# Altium project PSFB.PrjPcb (part 1 of 2)
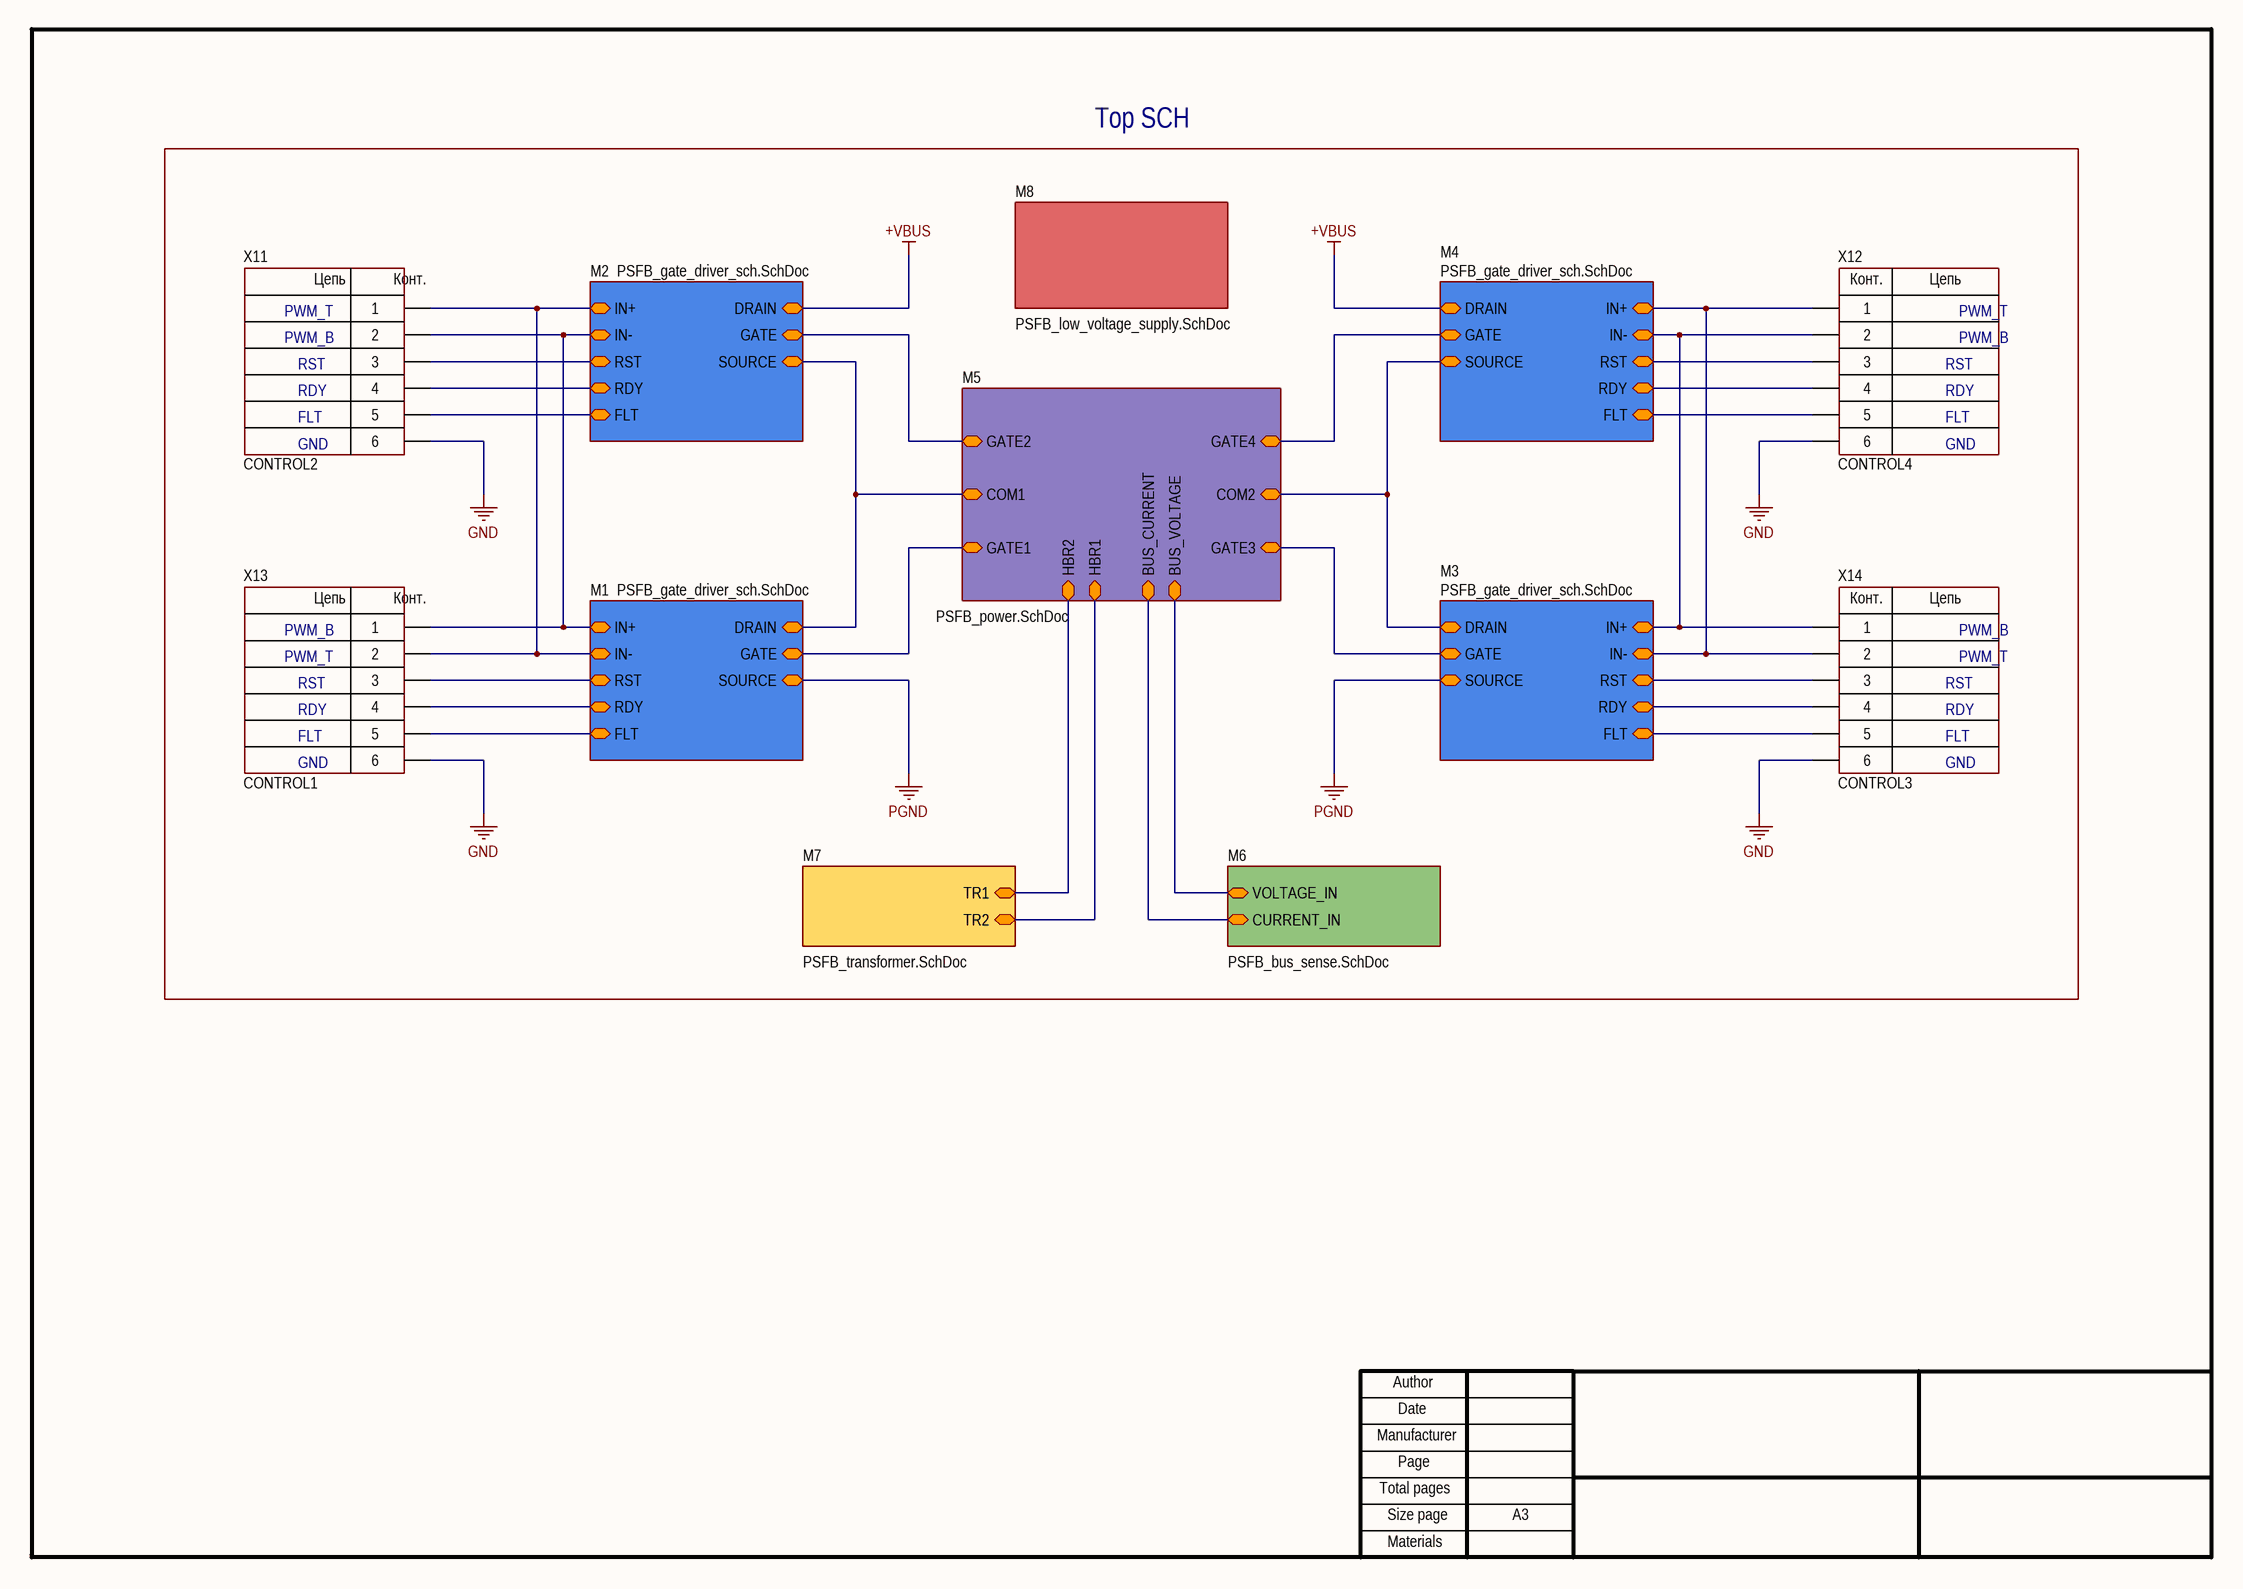
[diagram p0: PSFB_top_level.SchDoc]
6 sheets, 296 parts. Net scope: hierarchical (ports join the sheet entries above them; power ports are global).
Board file: PSFB_PCB.PcbDoc
Sheets:
  PSFB_top_level.SchDoc
    M6 = PSFB_bus_sense.SchDoc
    M1 = PSFB_gate_driver_sch.SchDoc
    M5 = PSFB_power.SchDoc
    M7 = PSFB_transformer.SchDoc
    M8 = PSFB_low_voltage_supply.SchDoc
    M2 = PSFB_gate_driver_sch.SchDoc
    M3 = PSFB_gate_driver_sch.SchDoc
    M4 = PSFB_gate_driver_sch.SchDoc

## Sheet PSFB_top_level.SchDoc
size 420 x 297 mm

### Parts
X11  CommentText: CONTROL2  [CON: SM06B-GHS]
X12  CommentText: CONTROL4  [CON: SM06B-GHS]
X13  CommentText: CONTROL1  [CON: SM06B-GHS]
X14  CommentText: CONTROL3  [CON: SM06B-GHS]

### Sub-sheets
M1 = PSFB_gate_driver_sch.SchDoc: RST (bidir), IN+ (bidir), RDY (bidir), FLT (bidir), IN- (bidir), GATE (bidir), SOURCE (bidir), DRAIN (bidir)
M2 = PSFB_gate_driver_sch.SchDoc: RST (bidir), IN+ (bidir), RDY (bidir), FLT (bidir), IN- (bidir), GATE (bidir), SOURCE (bidir), DRAIN (bidir)
M3 = PSFB_gate_driver_sch.SchDoc: RST (bidir), IN+ (bidir), RDY (bidir), FLT (bidir), IN- (bidir), GATE (bidir), SOURCE (bidir), DRAIN (bidir)
M4 = PSFB_gate_driver_sch.SchDoc: RST (bidir), IN+ (bidir), RDY (bidir), FLT (bidir), IN- (bidir), GATE (bidir), SOURCE (bidir), DRAIN (bidir)
M5 = PSFB_power.SchDoc: GATE1 (bidir), GATE2 (bidir), GATE3 (bidir), GATE4 (bidir), COM1 (bidir), COM2 (bidir), HBR1 (bidir), BUS_VOLTAGE (bidir), BUS_CURRENT (bidir), HBR2 (bidir)
M6 = PSFB_bus_sense.SchDoc: VOLTAGE_IN (bidir), CURRENT_IN (bidir)
M7 = PSFB_transformer.SchDoc: TR1 (bidir), TR2 (bidir)
M8 = PSFB_low_voltage_supply.SchDoc: no entries

### Nets
+VBUS: sheet M2/DRAIN, sheet M4/DRAIN
GND: X11.6 X12.6 X13.6 X14.6
PGND: sheet M1/SOURCE, sheet M3/SOURCE
NetC10_M2_2: sheet M1/DRAIN, sheet M5/COM1, sheet M2/SOURCE
NetC10_M4_2: sheet M5/COM2, sheet M5/HBR2, sheet M7/TR1, sheet M3/DRAIN, sheet M4/SOURCE
NetC27_2: sheet M5/HBR1, sheet M7/TR2
NetD4_M1_7: sheet M1/GATE, sheet M5/GATE1
NetD4_M2_7: sheet M5/GATE2, sheet M2/GATE
NetD4_M3_7: sheet M5/GATE3, sheet M3/GATE
NetD4_M4_7: sheet M5/GATE4, sheet M4/GATE
NetR1_2: sheet M6/VOLTAGE_IN, sheet M5/BUS_VOLTAGE
NetR5_2: sheet M6/CURRENT_IN, sheet M5/BUS_CURRENT
NetR12_M1_1: X13.4 ; sheet M1/RDY
NetR12_M2_1: X11.4 ; sheet M2/RDY
NetR12_M3_1: X14.4 ; sheet M3/RDY
NetR12_M4_1: X12.4 ; sheet M4/RDY
NetR14_M1_1: X13.5 ; sheet M1/FLT
NetR14_M2_1: X11.5 ; sheet M2/FLT
NetR14_M3_1: X14.5 ; sheet M3/FLT
NetR14_M4_1: X12.5 ; sheet M4/FLT
NetR16_M1_1: X13.3 ; sheet M1/RST
NetR16_M2_1: X11.3 ; sheet M2/RST
NetR16_M3_1: X14.3 ; sheet M3/RST
NetR16_M4_1: X12.3 ; sheet M4/RST
NetR17_M1_1: X11.2 X13.1 ; sheet M1/IN+, sheet M2/IN-
NetR17_M2_1: X11.1 X13.2 ; sheet M1/IN-, sheet M2/IN+
NetR17_M3_1: X12.2 X14.1 ; sheet M3/IN+, sheet M4/IN-
NetR17_M4_1: X12.1 X14.2 ; sheet M3/IN-, sheet M4/IN+

### Notes on the sheet
- Top SCH
- PWM_T
- PWM_B
- RST
- RDY
- FLT
- GND
- Author
- Manufacturer
- Date
- Page
- Total pages
- Size page
- A3
- Materials
- (in symbol Connector_SM06B) Цепь; Конт.

### Library data of the parts
X11-X14 = Connector_SM06B: Connector Header Surface Mount, Right Angle 6 position 0.039" (1.00mm); Manufacturer: JST; ValueManufacturerPartNumber: Connector, 6pin, 1.25mm, 50VDC, 1A; PartNumber: SM06B-GHS; VoltageMax: 50VDC; Pitch: 1.25mm; CurrentMax: 1A; Multichannel: 6pin; HelpURL: https://www.digikey.com/product-detail/en/jst-sales-america-inc/SM06B-GHS-TB-LF-SN/455-1568-1-ND/807836; TypeConnector: Connector

## Sheet PSFB_bus_sense.SchDoc
size 420 x 297 mm
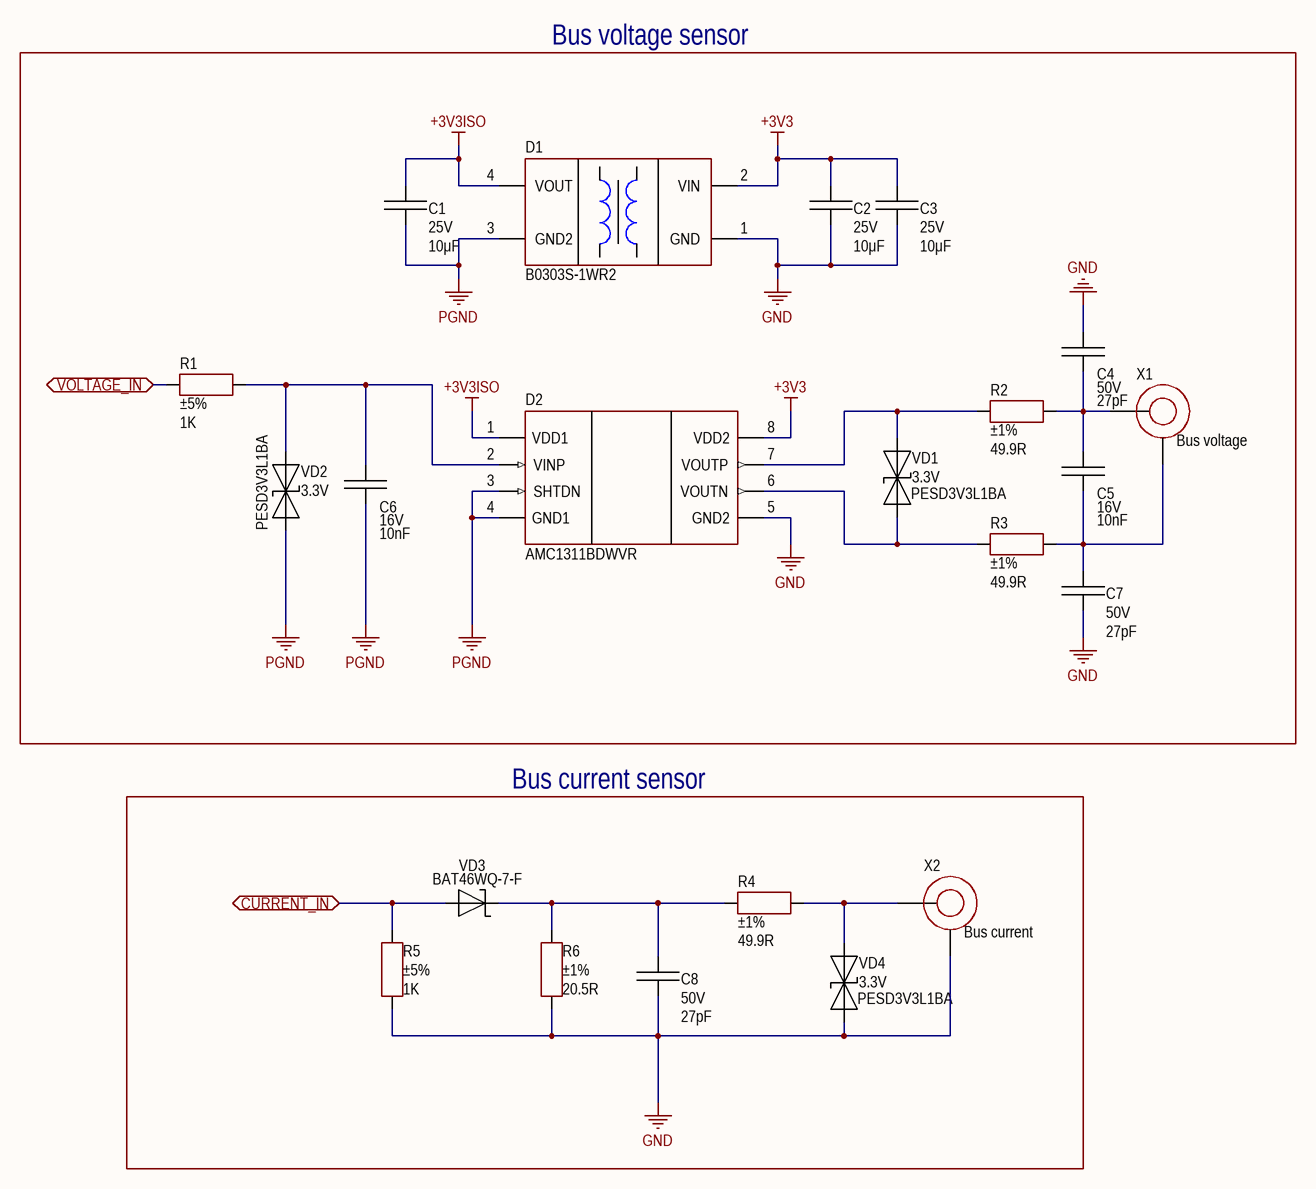
[diagram p1: PSFB_bus_sense.SchDoc]

### Parts
C1  value 10μF  Voltage: 25V  [CAP: 1206]
C2  value 10μF  Voltage: 25V  [CAP: 1206]
C3  value 10μF  Voltage: 25V  [CAP: 1206]
C4  value 27pF  Voltage: 50V  [CAP: 0805]
C5  value 10nF  Voltage: 16V  [CAP: 0805]
C6  value 10nF  Voltage: 16V  [CAP: 0805]
C7  value 27pF  Voltage: 50V  [CAP: 0805]
C8  value 27pF  Voltage: 50V  [CAP: 0805]
D1  PartNumber: B0303S-1WR2  [MOD: SIP-4 (B0505S-1W)]
D2  PartNumber: AMC1311BDWVR  [8-SOIC-W]
R1  value 1K  Tolerance: ±5%  [RES: 0805]
R2  value 49.9R  Tolerance: ±1%  [RES: 0805]
R3  value 49.9R  Tolerance: ±1%  [RES: 0805]
R4  value 49.9R  Tolerance: ±1%  [RES: 0805]
R5  value 1K  Tolerance: ±5%  [RES: 0805]
R6  value 20.5R  Tolerance: ±1%  [RES: 2512]
VD1  Voltage: 3.3V  PartNumber: PESD3V3L1BA  [DIODE: SOD323]
VD2  Voltage: 3.3V  PartNumber: PESD3V3L1BA  [DIODE: SOD323]
VD3  PartNumber: BAT46WQ-7-F  [DIODE: SOD123]
VD4  Voltage: 3.3V  PartNumber: PESD3V3L1BA  [DIODE: SOD323]
X1  CommentText: Bus voltage  [60311002111526]
X2  CommentText: Bus current  [60311002111526]

### Blocks framed on the sheet
Bus voltage sensor: C1-C7 D1 D2 R1-R3 VD1 VD2 X1
Bus current sensor: C8 R4-R6 VD3 VD4 X2

### Ports
CURRENT_IN (bidir), VOLTAGE_IN (bidir)

### Nets
+3V3: C2.2 C3.2 D1.2(VIN) D2.8(VDD2)
+3V3ISO: C1.2 D1.4(VOUT) D2.1(VDD1)
GND: C2.1 C3.1 C4.2 C7.2 C8.2 D1.1(GND) D2.5(GND2) R5.1 R6.1 VD4.1(A) X2.2
PGND: C1.1 C6.1 D1.3(GND2) D2.3(SHTDN) D2.4(GND1) VD2.1(A)
NetC4_1: C4.1 C5.2 R2.1 X1.1
NetC5_1: C5.1 C7.1 R3.1 X1.2
NetC6_2: C6.2 D2.2(VINP) R1.1 VD2.2(C)
NetC8_1: C8.1 R4.2 R6.2 VD3.2
NetD2_6: D2.6(VOUTN) R3.2 VD1.1(A)
NetD2_7: D2.7(VOUTP) R2.2 VD1.2(C)
NetR1_2: R1.2 ; port VOLTAGE_IN
NetR4_1: R4.1 VD4.2(C) X2.1
NetR5_2: R5.2 VD3.1 ; port CURRENT_IN

### Notes on the sheet
- Author
- Manufacturer
- Date
- Page
- Total pages
- Size page
- A3
- Materials

### Library data of the parts
C1-C3 = Ceramic_1206: 10µF ±10% 25V Ceramic Capacitor X7R 1206 (3216 Metric); Manufacturer: Yageo; PartNumber: CC1206KKX7R8BB106; ValueManufacturerPartNumber: Ceramic capacitor, 10μF, X7R, ±10%, 25V, 1206, -55...+125°C; Package: 1206; HelpURL: https://www.digikey.com/en/products/detail/yageo/CC1206KKX7R8BB106/5195365; Temperature: -55...+125°C; TypeCapacitor: Ceramic capacitor; Tolerance: ±10%; TypeDielectric: X7R
C4 C7 C8 = Ceramic_0805: 27pF ±5% 50V Ceramic Capacitor C0G, NP0 0805 (2012 Metric); Manufacturer: Yageo; PartNumber: CC0805JRNPO9BN270; ValueManufacturerPartNumber: Ceramic capacitor, 27pF, NP0, ±10%, 50V, 0805, -55...+125°C; Tolerance: ±10%; Package: 0805; HelpURL: https://www.digikey.com/en/products/detail/yageo/CC0805JRNPO9BN270/302838; Temperature: -55...+125°C; TypeCapacitor: Ceramic capacitor; TypeDielectric: NP0
C5 C6 = Ceramic_0805: 27pF ±5% 50V Ceramic Capacitor C0G, NP0 0805 (2012 Metric); Manufacturer: Yageo; PartNumber: CC0805JKNPO7BN103; ValueManufacturerPartNumber: Ceramic capacitor, 10nF, NP0, ±10%, 16V, 0805, -55...+125°C; Tolerance: ±10%; Package: 0805; HelpURL: https://www.digikey.com/en/products/detail/yageo/CC0805JKNPO7BN103/5884010; Temperature: -55...+125°C; TypeCapacitor: Ceramic capacitor; TypeDielectric: NP0
D1 = B0505S-1WR2: Isolated Module DC DC Converter 1 Output 3.3V 303mA 2.97V - 3.63V Input; Manufacturer: Mornsun; ValueManufacturerPartNumber: DC/DC converter, isolator, 5V 200mA, -40...+105°C, SIP-4; OutputType: isolator; OutputVoltage: 5V 200mA; HelpURL: https://lcsc.com/product-detail/Power-Modules_MORNSUN-Guangzhou-S-T-B0303S-1WR2_C70480.html; Package: SIP-4; ComponentType: DC/DC converter; Temperature: -40...+105°C
D2 = AMC1200BDWVR: Isolator amplifier; Manufacturer: Texas Instruments; ValueManufacturerPartNumber: IC isolator amplifier, Differential, 220 kHz, 2.7...5.5V, -40...+105°C, 8-SOIC; Supply: 2.7...5.5V; OutputType: Differential; GainBandwidth: 220 kHz; HelpURL: https://www.digikey.com/en/products/detail/texas-instruments/AMC1311BDWVR/8020495; Package: 8-SOIC; ComponentType: IC isolator amplifier; Temperature: -40...+105°C
R1 R5 = Resistor_0805: 1 kOhms ±5% 0.125W, 1/8W Chip Resistor 0805 (2012 Metric) Moisture Resistant Thick Film; Manufacturer: Yageo; PartNumber: RC0805JR-071KL; ValueManufacturerPartNumber: Resistor film, 1K, ±5%, 0805, 0.125W, -55...+125°C; TypeResistor: Resistor film; Package: 0805; HelpURL: https://www.digikey.com/en/products/detail/yageo/RC0805JR-071KL/728218; Temperature: -55...+125°C; Power: 0.125W
R2-R4 = Resistor_0805: 49.9 Ohms ±1% 0.125W, 1/8W Chip Resistor 0805 (2012 Metric) Moisture Resistant Thick Film; Manufacturer: Yageo; PartNumber: RC0805FR-0749R9L; ValueManufacturerPartNumber: Resistor film, 49.9R, ±1%, 0805, 0.125W, -55...+125°C; TypeResistor: Resistor film; Package: 0805; HelpURL: https://www.digikey.com/en/products/detail/yageo/RC0805FR-0749R9L/727984; Temperature: -55...+125°C; Power: 0.125W
R6 = Resistor_2512: 20.5 Ohms ±1% 1W Chip Resistor 2512 (6432 Metric) Moisture Resistant Thick Film; Manufacturer: Yageo; PartNumber: RC2512FK-0720R5L; ValueManufacturerPartNumber: Resistor film, 20.5R, ±1%, 2512, 1W, -55...+125°C; TypeResistor: Resistor film; Package: 2512; HelpURL: https://www.digikey.com/en/products/detail/yageo/RC2512FK-0720R5L/5921990; Temperature: -55...+125°C; Power: 1W
VD1 VD2 VD4 = TVS_single: 3.3V Reverse Standoff 26V Clamp 18A (8/20µs) Ipp Tvs Diode Surface Mount SOD-323; Manufacturer: Diodes Incorporated; Current: 500W; Package: SOD-323; HelpURL: https://www.digikey.com/en/products/detail/nexperia-usa-inc/PESD3V3L1BA-115/1157438; ValueManufacturerPartNumber: =TypeDiode+', '+Voltage+', '+Current+', '+VoltageDrop+', '+RecoveryTime+', '+Package+', '+Temperature; Temperature: -55...+150°C; TypeDiode: TVS diode
VD3 = Schottky_single: Diode Schottky 100V 150mA Surface Mount SOD-123; Manufacturer: Diodes Incorporated; ValueManufacturerPartNumber: Schottky diode, 100V, 1A, 0.45V, 15pF, SOD-123, -55...+150°C; TypeDiode: Schottky diode; Current: 1A; VoltageDrop: 0.45V; RecoveryTime: 15pF; Package: SOD-123; HelpURL: https://www.digikey.com/en/products/detail/diodes-incorporated/BAT46WQ-7-F/6003945; Temperature: -55...+150°C; Voltage: 100V
X1 X2 = Connector_SMA: SMA Connector Jack, Female Socket 50Ohm Through Hole Solder; Manufacturer: Würth Elektronik; ValueManufacturerPartNumber: Connector SMA, 50 Ohm, 6Hz; TypeConnector: Connector SMA; Frequency: 6Hz; HelpURL: https://www.we-online.com/catalog/en/WR-SMA_60311002111526; PartNumber: 60311002111526; Impedance: 50 Ohm

## Sheet PSFB_gate_driver_sch.SchDoc
size 420 x 297 mm; Address1: Address1; Address2: Address2; Address3: Address3; Address4: Address4; DocumentNumber: АБВГ.123456.001 Э3; SheetNumber: 1; Scale: 1:1; DocumentType: Схема электрическая принципиальная; FirstReferrence: АБВГ.123456.001
Used 4 times, as channels M1, M2, M3, M4. Parts and nets are listed once, with the designators drawn on the sheet.
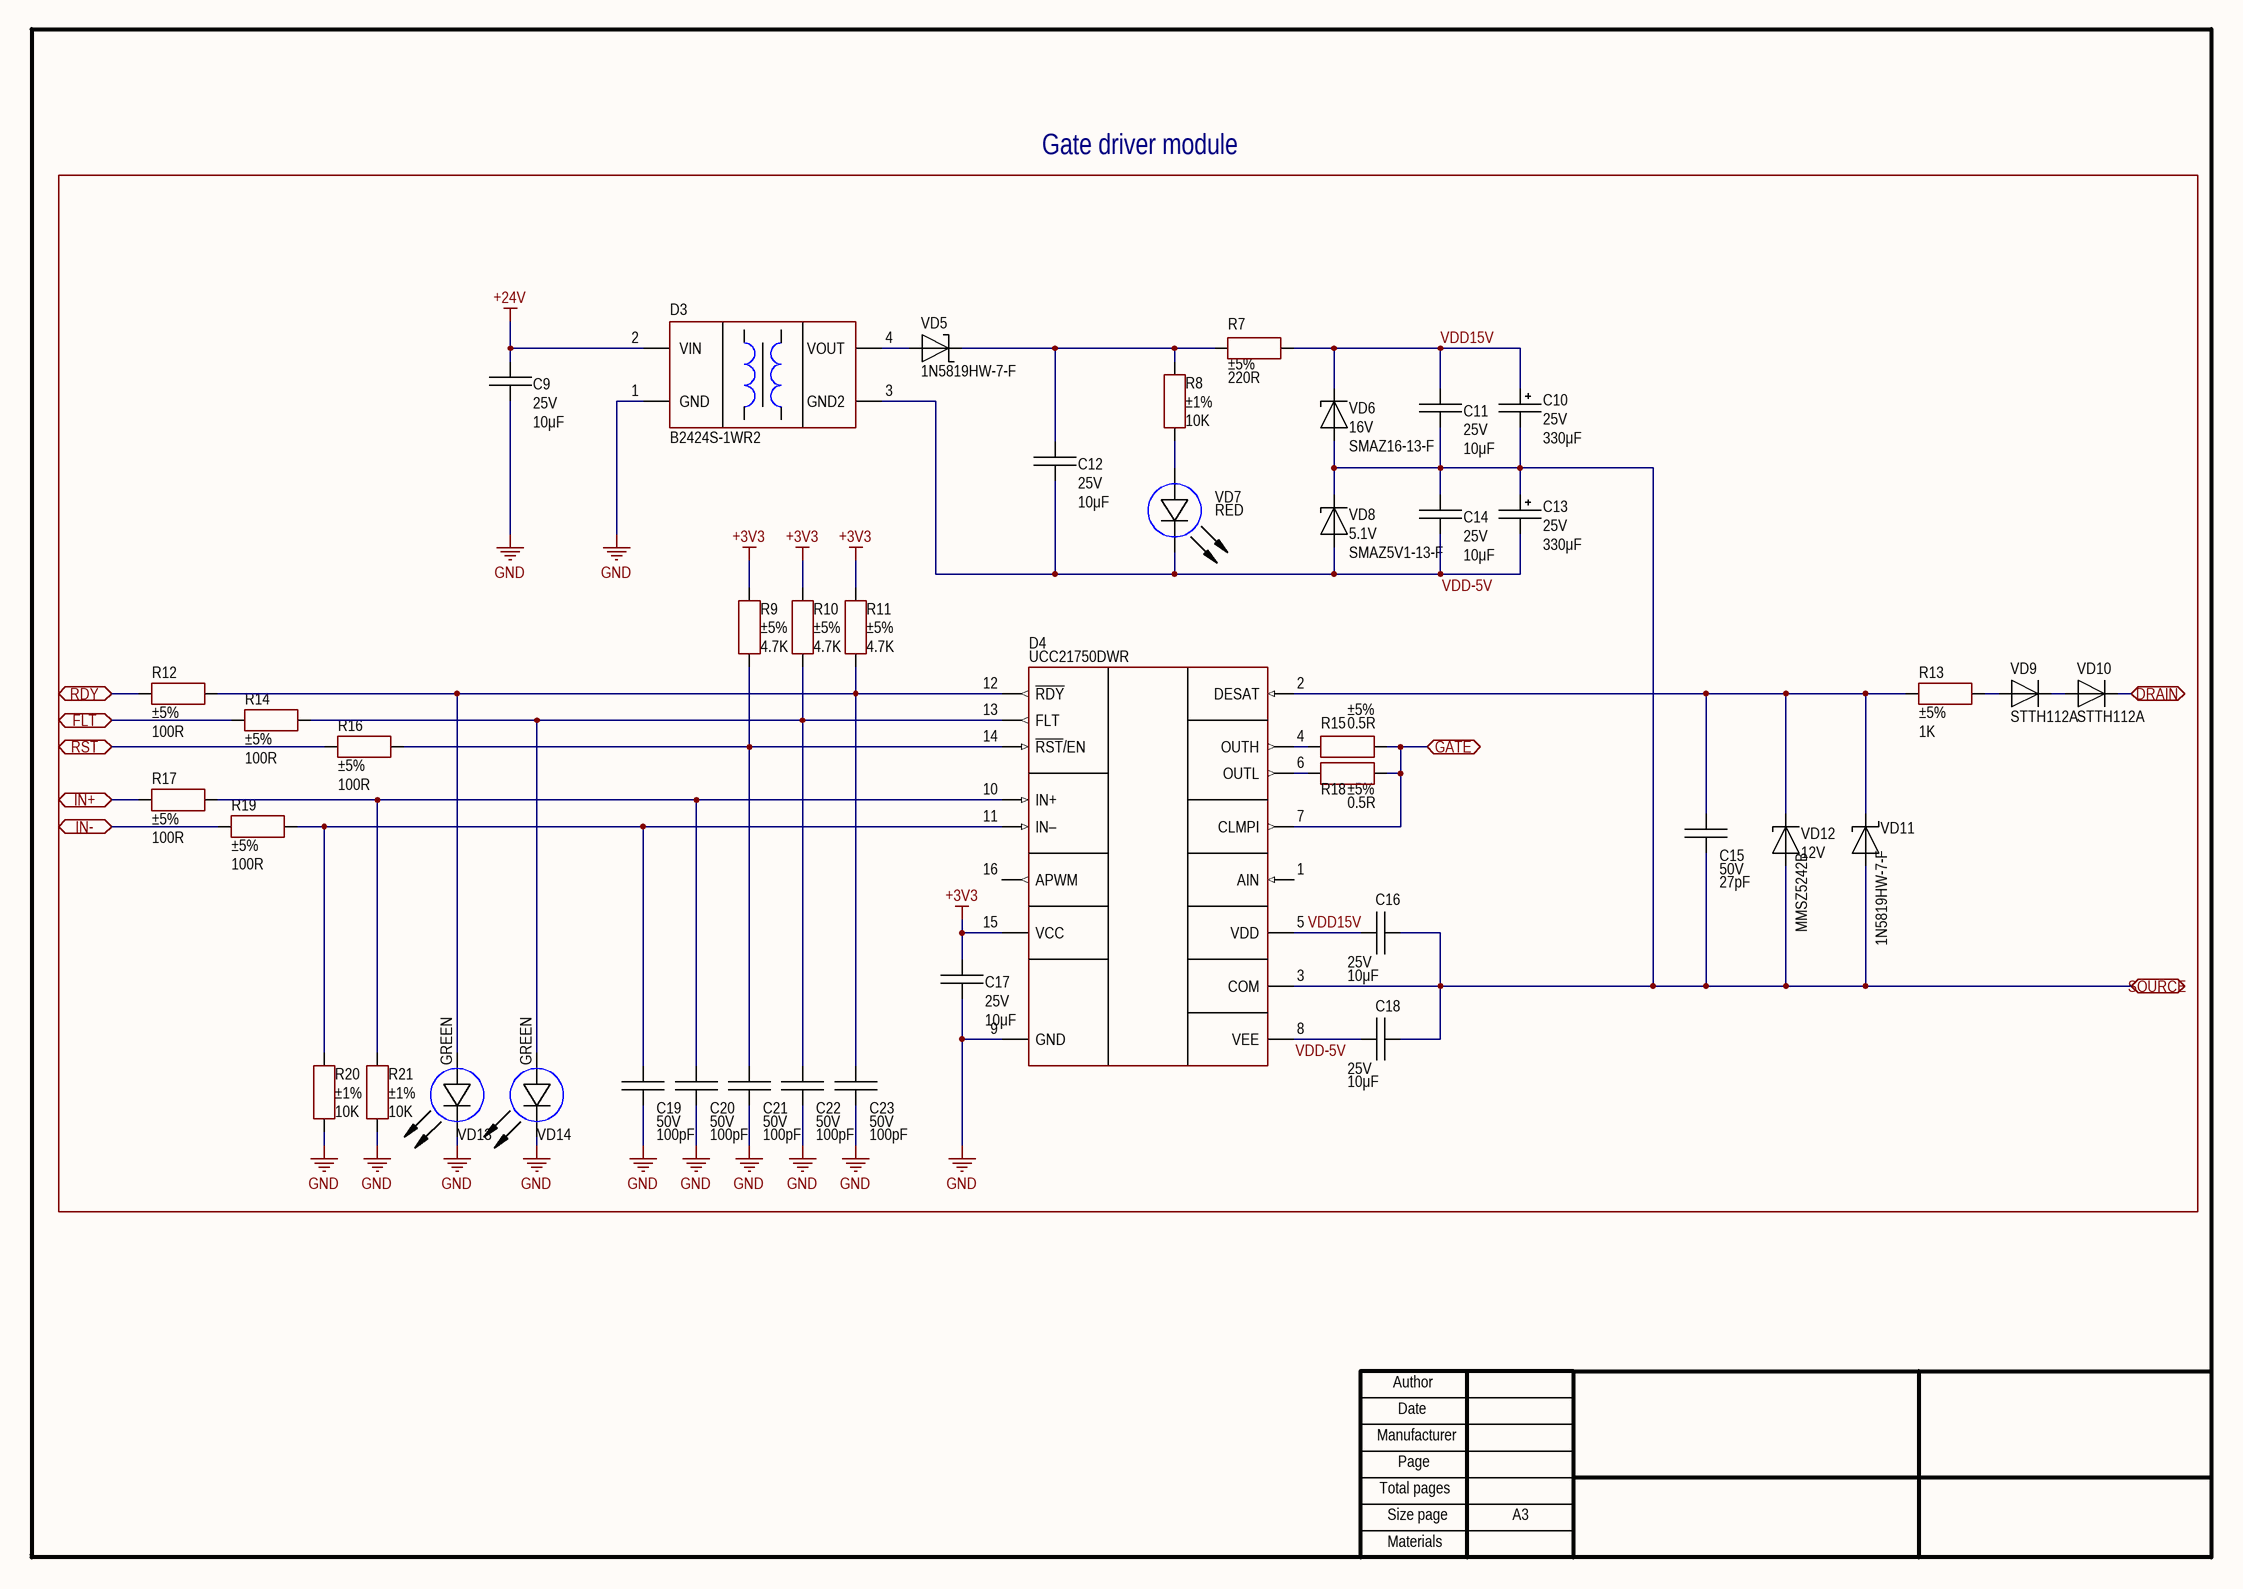
[diagram p2: PSFB_gate_driver_sch.SchDoc]

### Parts
C9  value 10μF  Voltage: 25V  [CAP: 1206]
C10  value 330μF  Voltage: 25V  [CAP: D8C3.5H12]
C11  value 10μF  Voltage: 25V  [CAP: 1206]
C12  value 10μF  Voltage: 25V  [CAP: 1206]
C13  value 330μF  Voltage: 25V  [CAP: D8C3.5H12]
C14  value 10μF  Voltage: 25V  [CAP: 1206]
C15  value 27pF  Voltage: 50V  [CAP: 0805]
C16  value 10μF  Voltage: 25V  [CAP: 1206]
C17  value 10μF  Voltage: 25V  [CAP: 1206]
C18  value 10μF  Voltage: 25V  [CAP: 1206]
C19  value 100pF  Voltage: 50V  [CAP: 0805]
C20  value 100pF  Voltage: 50V  [CAP: 0805]
C21  value 100pF  Voltage: 50V  [CAP: 0805]
C22  value 100pF  Voltage: 50V  [CAP: 0805]
C23  value 100pF  Voltage: 50V  [CAP: 0805]
D3  PartNumber: B2424S-1WR2  [MOD: SIP-4 (B0505S-1W)]
D4  (no value)  [16-SOIC]
R7  value 220R  Tolerance: ±5%  [RES: 2512]
R8  value 10K  Tolerance: ±1%  [RES: 0805]
R9  value 4.7K  Tolerance: ±5%  [RES: 0805]
R10  value 4.7K  Tolerance: ±5%  [RES: 0805]
R11  value 4.7K  Tolerance: ±5%  [RES: 0805]
R12  value 100R  Tolerance: ±5%  [RES: 0805]
R13  value 1K  Tolerance: ±5%  [RES: 0805]
R14  value 100R  Tolerance: ±5%  [RES: 0805]
R15  value 0.5R  Tolerance: ±5%  [RES: 2512]
R16  value 100R  Tolerance: ±5%  [RES: 0805]
R17  value 100R  Tolerance: ±5%  [RES: 0805]
R18  value 0.5R  Tolerance: ±5%  [RES: 2512]
R19  value 100R  Tolerance: ±5%  [RES: 0805]
R20  value 10K  Tolerance: ±1%  [RES: 0805]
R21  value 10K  Tolerance: ±1%  [RES: 0805]
VD5  PartNumber: 1N5819HW-7-F  [DIODE: SOD123]
VD6  Voltage: 16V  PartNumber: SMAZ16-13-F  [DIODE: SMA]
VD7  Color: RED  [LED: 0805R]
VD8  Voltage: 5.1V  PartNumber: SMAZ5V1-13-F  [DIODE: SMA]
VD9  PartNumber: STTH112A  [DIODE: SMA]
VD10  PartNumber: STTH112A  [DIODE: SMA]
VD11  PartNumber: 1N5819HW-7-F  [DIODE: SOD123]
VD12  Voltage: 12V  PartNumber: MMSZ5242B  [DIODE: SOD123]
VD13  Color: GREEN  [LED: 0805G]
VD14  Color: GREEN  [LED: 0805G]

### Blocks framed on the sheet
Gate driver module: C9-C23 D3 D4 R7-R21 VD5-VD14

### Ports
DRAIN (bidir), FLT (bidir), GATE (bidir), IN+ (bidir), IN- (bidir), RDY (bidir), RST (bidir), SOURCE (bidir)

### Nets
+3V3: C17.2 D4.15(VCC) R9.2 R10.2 R11.2
+24V: C9.2 D3.2(VIN)
GND: C9.1 C17.1 C19.1 C20.1 C21.1 C22.1 C23.1 D3.1(GND) D4.9(GND) R20.2 R21.2 VD13.2(C) VD14.2(C)
DRAIN: VD10.2 ; port DRAIN
FLT: R14.1 ; port FLT
GATE: D4.7(CLMPI) R15.2 R18.2 ; port GATE
IN+: R17.1 ; port IN+
IN-: R19.1 ; port IN-
RDY: R12.1 ; port RDY
RST: R16.1 ; port RST
SOURCE: C10.2 C11.2 C13.1 C14.1 C15.1 C16.1 C18.1 D4.3(COM) VD6.1(A) VD8.2(C) VD11.1 VD12.1(A) ; port SOURCE
VDD15V: C10.1 C11.1 C16.2 D4.5(VDD) R7.2 VD6.2(C)
VDD-5V: C12.1 C13.2 C14.2 C18.2 D3.3(GND2) D4.8(VEE) VD7.2(C) VD8.1(A)
NetC12_2: C12.2 R7.1 R8.2 VD5.2
NetC15_2: C15.2 D4.2(DESAT) R13.1 VD11.2 VD12.2(C)
NetC19_2: C19.2 D4.11(IN–) R19.2 R20.1
NetC20_2: C20.2 D4.10(IN+) R17.2 R21.1
NetC21_2: C21.2 D4.14(~{RST}/EN) R9.1 R16.2
NetC22_2: C22.2 D4.13(FLT) R10.1 R14.2 VD14.1(A)
NetC23_2: C23.2 D4.12(~{RDY}) R11.1 R12.2 VD13.1(A)
NetD3_4: D3.4(VOUT) VD5.1
NetD4_4: D4.4(OUTH) R15.1
NetD4_6: D4.6(OUTL) R18.1
NetR8_1: R8.1 VD7.1(A)
NetR13_2: R13.2 VD9.1
NetVD9_2: VD9.2 VD10.1

Not connected (* = marked no-connect by the designer): D4 1(AIN) 16(APWM)

### Channels
M1: designators end in _M1; ports DRAIN=NetC10_M2_2 FLT=NetR14_M1_1 GATE=NetD4_M1_7 IN+=NetR17_M1_1 IN-=NetR17_M2_1 RDY=NetR12_M1_1 RST=NetR16_M1_1 SOURCE=PGND
M2: designators end in _M2; ports DRAIN=+VBUS FLT=NetR14_M2_1 GATE=NetD4_M2_7 IN+=NetR17_M2_1 IN-=NetR17_M1_1 RDY=NetR12_M2_1 RST=NetR16_M2_1 SOURCE=NetC10_M2_2
M3: designators end in _M3; ports DRAIN=NetC10_M4_2 FLT=NetR14_M3_1 GATE=NetD4_M3_7 IN+=NetR17_M3_1 IN-=NetR17_M4_1 RDY=NetR12_M3_1 RST=NetR16_M3_1 SOURCE=PGND
M4: designators end in _M4; ports DRAIN=+VBUS FLT=NetR14_M4_1 GATE=NetD4_M4_7 IN+=NetR17_M4_1 IN-=NetR17_M3_1 RDY=NetR12_M4_1 RST=NetR16_M4_1 SOURCE=NetC10_M4_2

### Notes on the sheet
- Author
- Manufacturer
- Date
- Page
- Total pages
- Size page
- A3
- Materials

### Library data of the parts
C9 C11 C12 C14 C16-C18 = Ceramic_1206: as C1 on sheet PSFB_bus_sense; Package: 1206; HelpURL: https://www.digikey.com/en/products/detail/yageo/CC1206KKX7R8BB106/5195365; Temperature: -55...+125°C; TypeCapacitor: Ceramic capacitor; Tolerance: ±10%; TypeDielectric: X7R
C10 C13 = Aluminium: 330µF 25V Aluminum - Polymer Capacitors Radial, Can 18mOhm 2000 Hrs @ 105°C; Manufacturer: KEMET; PartNumber: A750KS337M1EAAE018; ValueManufacturerPartNumber: Aluminium capacitor, 330μF, 25V, ±20%, 18mOhm, 13x8x3.5 mm, -55...+105°C; TypeCapacitor: Aluminium capacitor; Tolerance: ±20%; Package: 13x8x3.5 mm; HelpURL: https://www.digikey.com/en/products/detail/kemet/A750KS337M1EAAE018/6196447; Temperature: -55...+105°C; Impedance: 18mOhm
C15 = Ceramic_0805: as C4 on sheet PSFB_bus_sense; Package: 0805; HelpURL: https://www.digikey.com/en/products/detail/yageo/CC0805JRNPO9BN270/302838; Temperature: -55...+125°C; TypeCapacitor: Ceramic capacitor; TypeDielectric: NP0
C19-C23 = Ceramic_0805: 100pF ±5% 50V Ceramic Capacitor C0G, NP0 0805 (2012 Metric); Manufacturer: Yageo; PartNumber: CC0805JRNPO9BN101; ValueManufacturerPartNumber: Ceramic capacitor, 100pF, NP0, ±10%, 50V, 0805, -55...+125°C; Tolerance: ±10%; Package: 0805; HelpURL: https://www.digikey.com/en/products/detail/yageo/CC0805JRNPO9BN101/302845; Temperature: -55...+125°C; TypeCapacitor: Ceramic capacitor; TypeDielectric: NP0
D3 = B0505S-1WR2: Isolated Module DC DC Converter 1 Output 24V 42mA 21.6V - 26.4V Input; Manufacturer: Mornsun; ValueManufacturerPartNumber: DC/DC converter, Isolator, 24V 42mA, -40...+105°C, SIP-4; OutputType: Isolator; HelpURL: https://www.chipdip.ru/product/b0505s-1wr2; Package: SIP-4; ComponentType: DC/DC converter; Temperature: -40...+105°C; OutputVoltage: 24V 42mA
D4 = UCC21750DWR: 10A Gate Driver Capacitive Coupling 5700Vrms 1 Channel 16-SOIC; Manufacturer: Texas Instruments; VoltageSupply: supply 3...5.5V; VoltageWork: 1200V; CMTI: 150kV/μs; HelpURL: https://www.digikey.com/en/products/detail/texas-instruments/UCC21750DWR/11502037; Package: 16-SOIC; ComponentType: Isolated gate driver; ValueManufacturerPartNumber: =ComponentType+', '+VoltageWork+', '+Frequency+', '+CurrentOutput+', '+CMTI+', '+VoltageSupply+', '+Temperature+', '+Package; Temperature: -40...+125°C; CurrentOutput: ±10A; PartNumber: UCC21750DWR
R7 = Resistor_2512: 220 Ohms ±5% 1W Chip Resistor 2512 (6432 Metric) Moisture Resistant Thick Film; Manufacturer: Yageo; PartNumber: RC2512JK-07220RL; ValueManufacturerPartNumber: Resistor film, 220R, ±5%, 2512, 1W, -55...+125°C; TypeResistor: Resistor film; Package: 2512; HelpURL: https://www.digikey.com/en/products/detail/yageo/RC2512JK-07220RL/5922529; Temperature: -55...+125°C; Power: 1W
R8 R20 R21 = Resistor_0805: 10 kOhms ±1% 0.125W, 1/8W Chip Resistor 0805 (2012 Metric) Moisture Resistant Thick Film; Manufacturer: Yageo; PartNumber: RC0805FR-0710KL; ValueManufacturerPartNumber: Resistor film, 10K, ±1%, 0805, 0.125W, -55...+125°C; TypeResistor: Resistor film; Package: 0805; HelpURL: https://www.digikey.com/en/products/detail/yageo/RC0805FR-0710KL/727535; Temperature: -55...+125°C; Power: 0.125W
R9-R11 = Resistor_0805: 4.7 kOhms ±5% 0.125W, 1/8W Chip Resistor 0805 (2012 Metric) Moisture Resistant Thick Film; Manufacturer: Yageo; PartNumber: RC0805JR-074K7L; ValueManufacturerPartNumber: Resistor film, 4.7K, ±5%, 0805, 0.125W, -55...+125°C; TypeResistor: Resistor film; Package: 0805; HelpURL: https://www.digikey.com/en/products/detail/yageo/RC0805JR-074K7L/728327; Temperature: -55...+125°C; Power: 0.125W
R12 R14 R16 R17 R19 = Resistor_0805: 100 Ohms ±5% 0.125W, 1/8W Chip Resistor 0805 (2012 Metric) Moisture Resistant Thick Film; Manufacturer: Yageo; PartNumber: RC0805JR-07100RL; ValueManufacturerPartNumber: Resistor film, 100R, ±5%, 0805, 0.125W, -55...+125°C; TypeResistor: Resistor film; Package: 0805; HelpURL: https://www.digikey.com/product-detail/en/yageo/RC0805JR-07100RL/311-100ARCT-ND/731185; Temperature: -55...+125°C; Power: 0.125W
R13 = Resistor_0805: as R1 on sheet PSFB_bus_sense; Package: 0805; HelpURL: https://www.digikey.com/en/products/detail/yageo/RC0805JR-071KL/728218; Temperature: -55...+125°C; Power: 0.125W
R15 R18 = Resistor_2512: 500 mOhms ±5% 1W Chip Resistor 2512 (6432 Metric) Automotive AEC-Q200, Current Sense, Moisture Resistant Thick Film; Manufacturer: Yageo; PartNumber: RC2512JK-07100RL; ValueManufacturerPartNumber: Resistor film, 0.5R, ±5%, 2512, 1W, -55...+125°C; TypeResistor: Resistor film; Package: 2512; HelpURL: https://www.digikey.com/en/products/detail/yageo/RL2512JK-070R5L/5925490; Temperature: -55...+125°C; Power: 1W
VD5 VD11 = Schottky_single: Diode Schottky 40V 1A Surface Mount SOD-123C; Manufacturer: Diodes Incorporated; ValueManufacturerPartNumber: Schottky diode, 40V, 1A, 0.45V, 15pF, SOD-123, -55...+150°C; TypeDiode: Schottky diode; VoltageDrop: 0.45V; RecoveryTime: 15pF; Package: SOD-123; HelpURL: https://www.digikey.com/en/products/detail/diodes-incorporated/1N5819HW-7-F/814970; Temperature: -55...+150°C; Voltage: 40V; Current: 1A
VD6 = Zener_single: Zener Diode 16V 1W ±5% Surface Mount SMA; Manufacturer: Diodes Incorporated; ValueManufacturerPartNumber: Zener diode, 16V, 1W, 0.9V, 17Ohm, SMA, -55...+150°C; VoltageDrop: 0.9V; RecoveryTime: 17Ohm; Package: SMA; HelpURL: https://www.digikey.com/en/products/detail/diodes-incorporated/SMAZ16-13-F/808526; Temperature: -55...+150°C; TypeDiode: Zener diode; Current: 1W
VD7 = LED_single: Red 631nm LED Indication - Discrete 2V 0805 (2012 Metric); Manufacturer: Lite-On Inc.; ValueManufacturerPartNumber: LED, Red, 20mA, 2V, 0805, -55...+150°C; PartNumber: LTST-C171KRKT; Current: 20mA; Package: 0805; HelpURL: https://www.digikey.com/en/products/detail/lite-on-inc/LTST-C171KRKT/386801; Temperature: -55...+150°C; TypeDiode: LED; VoltageDrop: 2V; ColorParameter: Red
VD8 = Zener_single: Zener Diode 5.1V 1W ±5% Surface Mount SMA; Manufacturer: Diodes Incorporated; ValueManufacturerPartNumber: Zener diode, 5.1V, 1W, 0.9V, 17Ohm, SMA, -55...+150°C; VoltageDrop: 0.9V; RecoveryTime: 17Ohm; Package: SMA; HelpURL: https://www.digikey.com/en/products/detail/diodes-incorporated/SMAZ5V1-13-F/725036; Temperature: -55...+150°C; TypeDiode: Zener diode; Current: 1W
VD9 VD10 = Diode_single: Diode Standard 1200V 1A Surface Mount SMA; Manufacturer: STMicroelectronics; ValueManufacturerPartNumber: Single diode, 1200V, 1A, 1.9V, 75ns, SMA, -55...+150°C; TypeDiode: Single diode; VoltageDrop: 1.9V; RecoveryTime: 75ns; Package: SMA; HelpURL: https://www.digikey.com/en/products/detail/stmicroelectronics/STTH112A/1039767; Temperature: -55...+150°C; Voltage: 1200V; Current: 1A
VD12 = Zener_single: Zener Diode 12V 500mW ±5% Surface Mount SOD-123; Manufacturer: Diodes Incorporated; ValueManufacturerPartNumber: Zener diode, 12V, 500mW, 0.9V, 17Ohm, SOD-123, -55...+150°C; VoltageDrop: 0.9V; RecoveryTime: 17Ohm; Package: SOD-123; HelpURL: https://www.digikey.com/en/products/detail/on-semiconductor/MMSZ5242B/1048676; Temperature: -55...+150°C; TypeDiode: Zener diode; Current: 500mW
VD13 VD14 = LED_single: Green 571nm LED Indication - Discrete 2V 0805 (2012 Metric); Manufacturer: Lite-On Inc.; ValueManufacturerPartNumber: LED, Green, 20mA, 2V, 0805, -55...+150°C; PartNumber: LTST-C170GKT; Current: 20mA; Package: 0805; HelpURL: https://www.digikey.com/en/products/detail/lite-on-inc/LTST-C171KGKT/386799; Temperature: -55...+150°C; TypeDiode: LED; VoltageDrop: 2V; ColorParameter: Green

## Sheet PSFB_power.SchDoc
size 420 x 297 mm
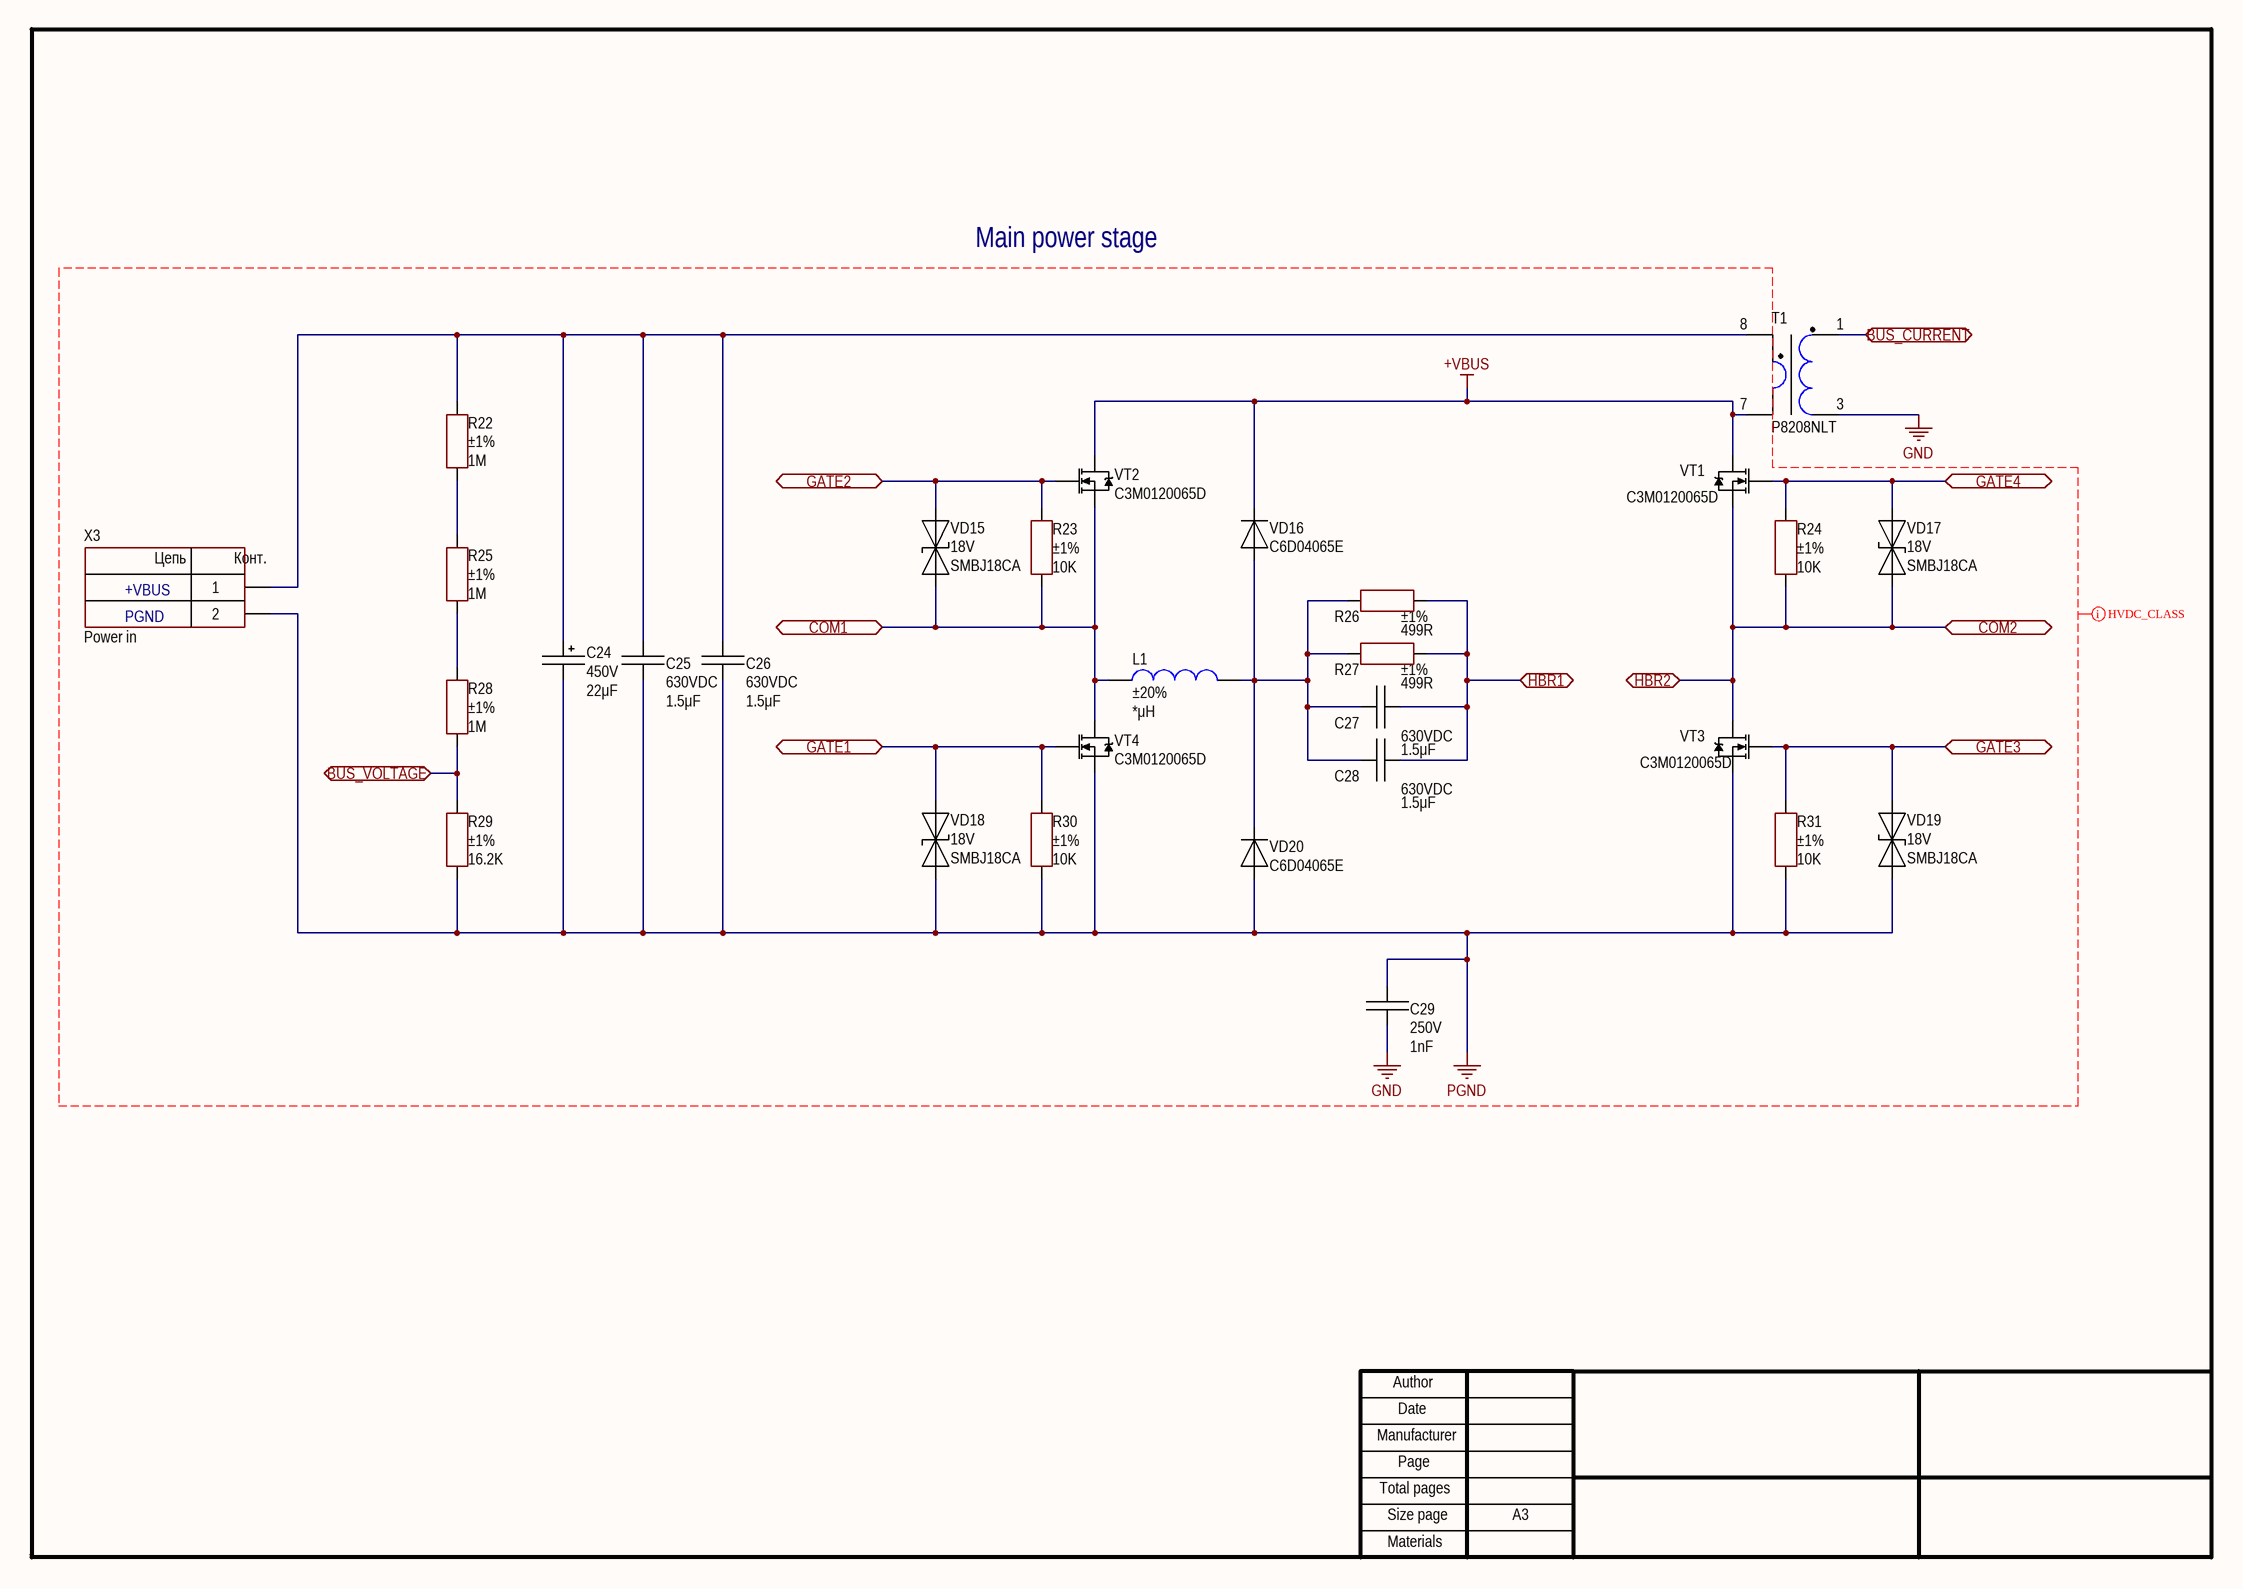
[diagram p3: PSFB_power.SchDoc]

### Parts
C24  value 22μF  Voltage: 450V  [CAP: D16C7.5H25]
C25  value 1.5μF  Voltage: 630VDC  [WCAP-FTBP_L31W16H25.5]
C26  value 1.5μF  Voltage: 630VDC  [WCAP-FTBP_L31W16H25.5]
C27  value 1.5μF  Voltage: 630VDC  [WCAP-FTBP_L31W16H25.5]
C28  value 1.5μF  Voltage: 630VDC  [WCAP-FTBP_L31W16H25.5]
C29  value 1nF  Voltage: 250V  [WCAP-CSSA_2211_H2.5]
L1  value *μH  Tolerance: ±20%  [IND: R26.9/14.7/11.2 (H)]
R22  value 1M  Tolerance: ±1%  [RES: 1206]
R23  value 10K  Tolerance: ±1%  [RES: 0805]
R24  value 10K  Tolerance: ±1%  [RES: 0805]
R25  value 1M  Tolerance: ±1%  [RES: 1206]
R26  value 499R  Tolerance: ±1%  [RES: 2512]
R27  value 499R  Tolerance: ±1%  [RES: 2512]
R28  value 1M  Tolerance: ±1%  [RES: 1206]
R29  value 16.2K  Tolerance: ±1%  [RES: 1206]
R30  value 10K  Tolerance: ±1%  [RES: 0805]
R31  value 10K  Tolerance: ±1%  [RES: 0805]
T1  PartNumber: P8208NLT  [TRANS: P8208NLT]
VD15  Voltage: 18V  PartNumber: SMBJ18CA  [DIODE: SMB]
VD16  PartNumber: C6D04065E  [DPAK (D)]
VD17  Voltage: 18V  PartNumber: SMBJ18CA  [DIODE: SMB]
VD18  Voltage: 18V  PartNumber: SMBJ18CA  [DIODE: SMB]
VD19  Voltage: 18V  PartNumber: SMBJ18CA  [DIODE: SMB]
VD20  PartNumber: C6D04065E  [DPAK (D)]
VT1  PartNumber: C3M0120065D  [TO247(H)]
VT2  PartNumber: C3M0120065D  [TO247(H)]
VT3  PartNumber: C3M0120065D  [TO247(H)]
VT4  PartNumber: C3M0120065D  [TO247(H)]
X3  CommentText: Power in  [CON: 2453690000]

### Ports
BUS_CURRENT (bidir), BUS_VOLTAGE (bidir), COM1 (bidir), COM2 (bidir), GATE1 (bidir), GATE2 (bidir), GATE3 (bidir), GATE4 (bidir), HBR1 (bidir), HBR2 (bidir)

### Nets
+VBUS: T1.7 VD16.2 VT1.2(D) VT2.2(D)
GND: C29.2 T1.3
PGND: C24.2 C25.1 C26.1 C29.1 R29.1 R30.1 R31.1 VD18.2(C) VD19.2(C) VD20.1 VT3.3(S) VT4.3(S) X3.2
NetC10_M2_2: L1.2 R23.1 VD15.2(C) VT2.3(S) VT4.2(D) ; port COM1
NetC10_M4_2: R24.1 VD17.2(C) VT1.3(S) VT3.2(D) ; port COM2, port HBR2
NetC24_1: C24.1 C25.2 C26.2 R22.2 T1.8 X3.1
NetC27_1: C27.1 C28.1 L1.1 R26.1 R27.1 VD16.1 VD20.2
NetC27_2: C27.2 C28.2 R26.2 R27.2 ; port HBR1
NetD4_M1_7: R30.2 VD18.1(A) VT4.1(G) ; port GATE1
NetD4_M2_7: R23.2 VD15.1(A) VT2.1(G) ; port GATE2
NetD4_M3_7: R31.2 VD19.1(A) VT3.1(G) ; port GATE3
NetD4_M4_7: R24.2 VD17.1(A) VT1.1(G) ; port GATE4
NetR1_2: R28.1 R29.2 ; port BUS_VOLTAGE
NetR5_2: T1.1 ; port BUS_CURRENT
NetR22_1: R22.1 R25.2
NetR25_1: R25.1 R28.2

### Layout directives
net class HVDC_CLASS: +VBUS, GND, PGND

### Notes on the sheet
- Main power stage
- +VBUS
- PGND
- Author
- Manufacturer
- Date
- Page
- Total pages
- Size page
- A3
- Materials
- (in symbol LUF-10.00) Цепь; Конт.

### Library data of the parts
C24 = Aluminium: 22µF 450V Aluminum Electrolytic Capacitors Radial, Can  12000 Hrs @ 105°C; Manufacturer: Rubycon; PartNumber: A750KS337M1EAAE018; TypeCapacitor: Aluminium capacitor; Tolerance: ±20%; Package: 13x8x3.5 mm; HelpURL: https://www.digikey.com/en/products/detail/rubycon/450BXC22MEFC16X20/3564354; ValueManufacturerPartNumber: =TypeCapacitor+', '+Value+', '+Voltage+', '+Tolerance+', '+Impedance+', '+Package+', '+Temperature; Temperature: -55...+105°C
C25-C28 = Film: 1.5µF Film Capacitor  630V Polypropylene (PP), Metallized RadialC; Manufacturer: Würth Elektronik; PartNumber: 890303327008CS; ValueManufacturerPartNumber: Film capacitor, 1.5μF, 630VDC, ±10%, 22mOhm, 31x16x26.5mm, -40...+105°C; Tolerance: ±10%; Impedance: 22mOhm; Package: 31x16x26.5mm; HelpURL: https://www.digikey.com/en/products/detail/w%C3%BCrth-elektronik/890303327008CS/8324661; Temperature: -40...+105°C; TypeCapacitor: Film capacitor
C29 = Ceramic_2211: 1000pF ±10% 250V Ceramic Capacitor X7R 2211 (5728 Metric); Manufacturer: Yageo; PartNumber: 8853522130111; ValueManufacturerPartNumber: Ceramic capacitor, 1nF, X7R, ±10%, 250V, 2211, -55...+125°C; Package: 2211; HelpURL: https://www.digikey.com/en/products/detail/w%C3%BCrth-elektronik/8853522130111/6140841; Temperature: -55...+125°C; TypeCapacitor: Ceramic capacitor; Tolerance: ±10%; TypeDielectric: X7R
L1 = Inductor_R26.9/14.7/11.2: Custom inductor, DNP; Manufacturer: Magnetics; PartNumber: 0077930A7; ValueManufacturerPartNumber: Fixed inductor, *μH, ±20%, R26.9/14.7/11.2, Kool Mu, µ=125, 157 нГн/витков2; TypeInductor: Fixed inductor; TypeMatiriel: Kool Mu; AL: 157 нГн/витков2; MaterialPermeability: µ=125; Package: R26.9/14.7/11.2; HelpURL: http://ferrite.ru/warehouse/r-26-914-711-2-77930-a7.html
R22 R25 R28 = Resistor_1206: 1 MOhms ±1% 0.25W, 1/4W Chip Resistor 1206 (3216 Metric) Moisture Resistant Thick Film; Manufacturer: Yageo; PartNumber: RC1206FR-071ML; ValueManufacturerPartNumber: Resistor film, 1M, ±1%, 1206, 0.25W, -55...+125°C; TypeResistor: Resistor film; Package: 1206; HelpURL: https://www.digikey.com/en/products/detail/yageo/RC1206FR-071ML/728388; Temperature: -55...+125°C; Power: 0.25W
R23 R24 R30 R31 = Resistor_0805: as R8 on sheet PSFB_gate_driver_sch; Package: 0805; HelpURL: https://www.digikey.com/en/products/detail/yageo/RC0805FR-0710KL/727535; Temperature: -55...+125°C; Power: 0.125W
R26 R27 = Resistor_2512: 499 Ohms ±1% 1W Chip Resistor 2512 (6432 Metric) Moisture Resistant Thick Film; Manufacturer: Yageo; PartNumber: RC2512FK-07499RL; ValueManufacturerPartNumber: Resistor film, 499R, ±1%, 2512, 1W, -55...+125°C; TypeResistor: Resistor film; Package: 2512; HelpURL: https://www.digikey.com/en/products/detail/yageo/RC2512FK-07499RL/5922242; Temperature: -55...+125°C; Power: 1W
R29 = Resistor_1206: 16.2 kOhms ±1% 0.25W, 1/4W Chip Resistor 1206 (3216 Metric) Moisture Resistant Thick Film; Manufacturer: Yageo; PartNumber: RC1206FR-0716K2L; ValueManufacturerPartNumber: Resistor film, 16.2K, ±1%, 1206, 0.25W, -55...+125°C; TypeResistor: Resistor film; Package: 1206; HelpURL: https://www.digikey.com/en/products/detail/yageo/RC1206FR-0716K2L/728570; Temperature: -55...+125°C; Power: 0.25W
T1 = Current_P8208NLT: 1:100 Current Sense Transformer 50kHz ~ 1MHz 6mOhm Primary, 5.5Ohm Secondary 2mH Surface Mount; Manufacturer: Pulse Electronics; ValueManufacturerPartNumber: Current transformer, 1:100, 50...1000 kHz; TypeTransformer: Current transformer; Power: 50...1000 kHz; HelpURL: https://www.digikey.com/product-detail/en/pulse-electronics-power/P8208NLT/553-1523-1-ND/2362921; Voltage: 1:100
VD15 VD17-VD19 = TVS_single: 29.2V Clamp 20.6A Ipp Tvs Diode Surface Mount DO-214AA (SMBJ); Manufacturer: Diodes Incorporated; Current: 600W; Package: SMB; HelpURL: https://www.digikey.com/en/products/detail/littelfuse-inc/SMBJ18CA/285986; ValueManufacturerPartNumber: =TypeDiode+', '+Voltage+', '+Current+', '+VoltageDrop+', '+RecoveryTime+', '+Package+', '+Temperature; Temperature: -55...+150°C; TypeDiode: TVS diode
VD16 VD20 = Diode_single: Diode Silicon Carbide Schottky 650V 8A (DC) Surface Mount TO-252-2; Manufacturer: Wolfspeed; ValueManufacturerPartNumber: Single diode, 650V, 1A, 1.5V, 0ns, TO-252-2, -55...+150°C; TypeDiode: Single diode; Current: 1A; VoltageDrop: 1.5V; RecoveryTime: 0ns; Package: TO-252-2; HelpURL: https://www.digikey.com/en/products/detail/cree-wolfspeed/C6D04065E/12525322; Temperature: -55...+150°C; Voltage: 650V
VT1-VT4 = MOSFET_N_123: N-Channel 650V 22A (Tc) 98W (Tc) SiC MOSFET Through Hole TO-247-3; Manufacturer: Infineon Technologies; ValueManufacturerPartNumber: MOSFET N-channel transistor, 650V, 22A, 26nC, 98W, 120mOhm, 756pF, TO247-3, -55...+150°C; TypeTransistor: MOSFET N-channel transistor; RDS: 120mOhm; GateCharge: 26nC; InputCapacitor: 756pF; Package: TO247-3; HelpURL: https://www.richardsonrfpd.com/Products/Product/C3M0120065D; Temperature: -55...+150°C; VoltageDS: 650V; CurrentDS: 22A; MaxPower: 98W
X3 = LUF-10.00: 2 Position Wire to Board Terminal Block Horizontal with Board 0.394" (10.00mm) Through Hole; Manufacturer: Weidmüller; ValueManufacturerPartNumber: Connector, 2pin, 10mm, 600V, 60A; PartNumber: 2453690000; TypeConnector: Connector; VoltageMax: 600V; Pitch: 10mm; CurrentMax: 60A; Multichannel: 2pin; HelpURL: https://www.digikey.com/en/products/detail/weidm%C3%BCller/2453690000/9637690

## Sheet PSFB_transformer.SchDoc
size 594 x 420 mm
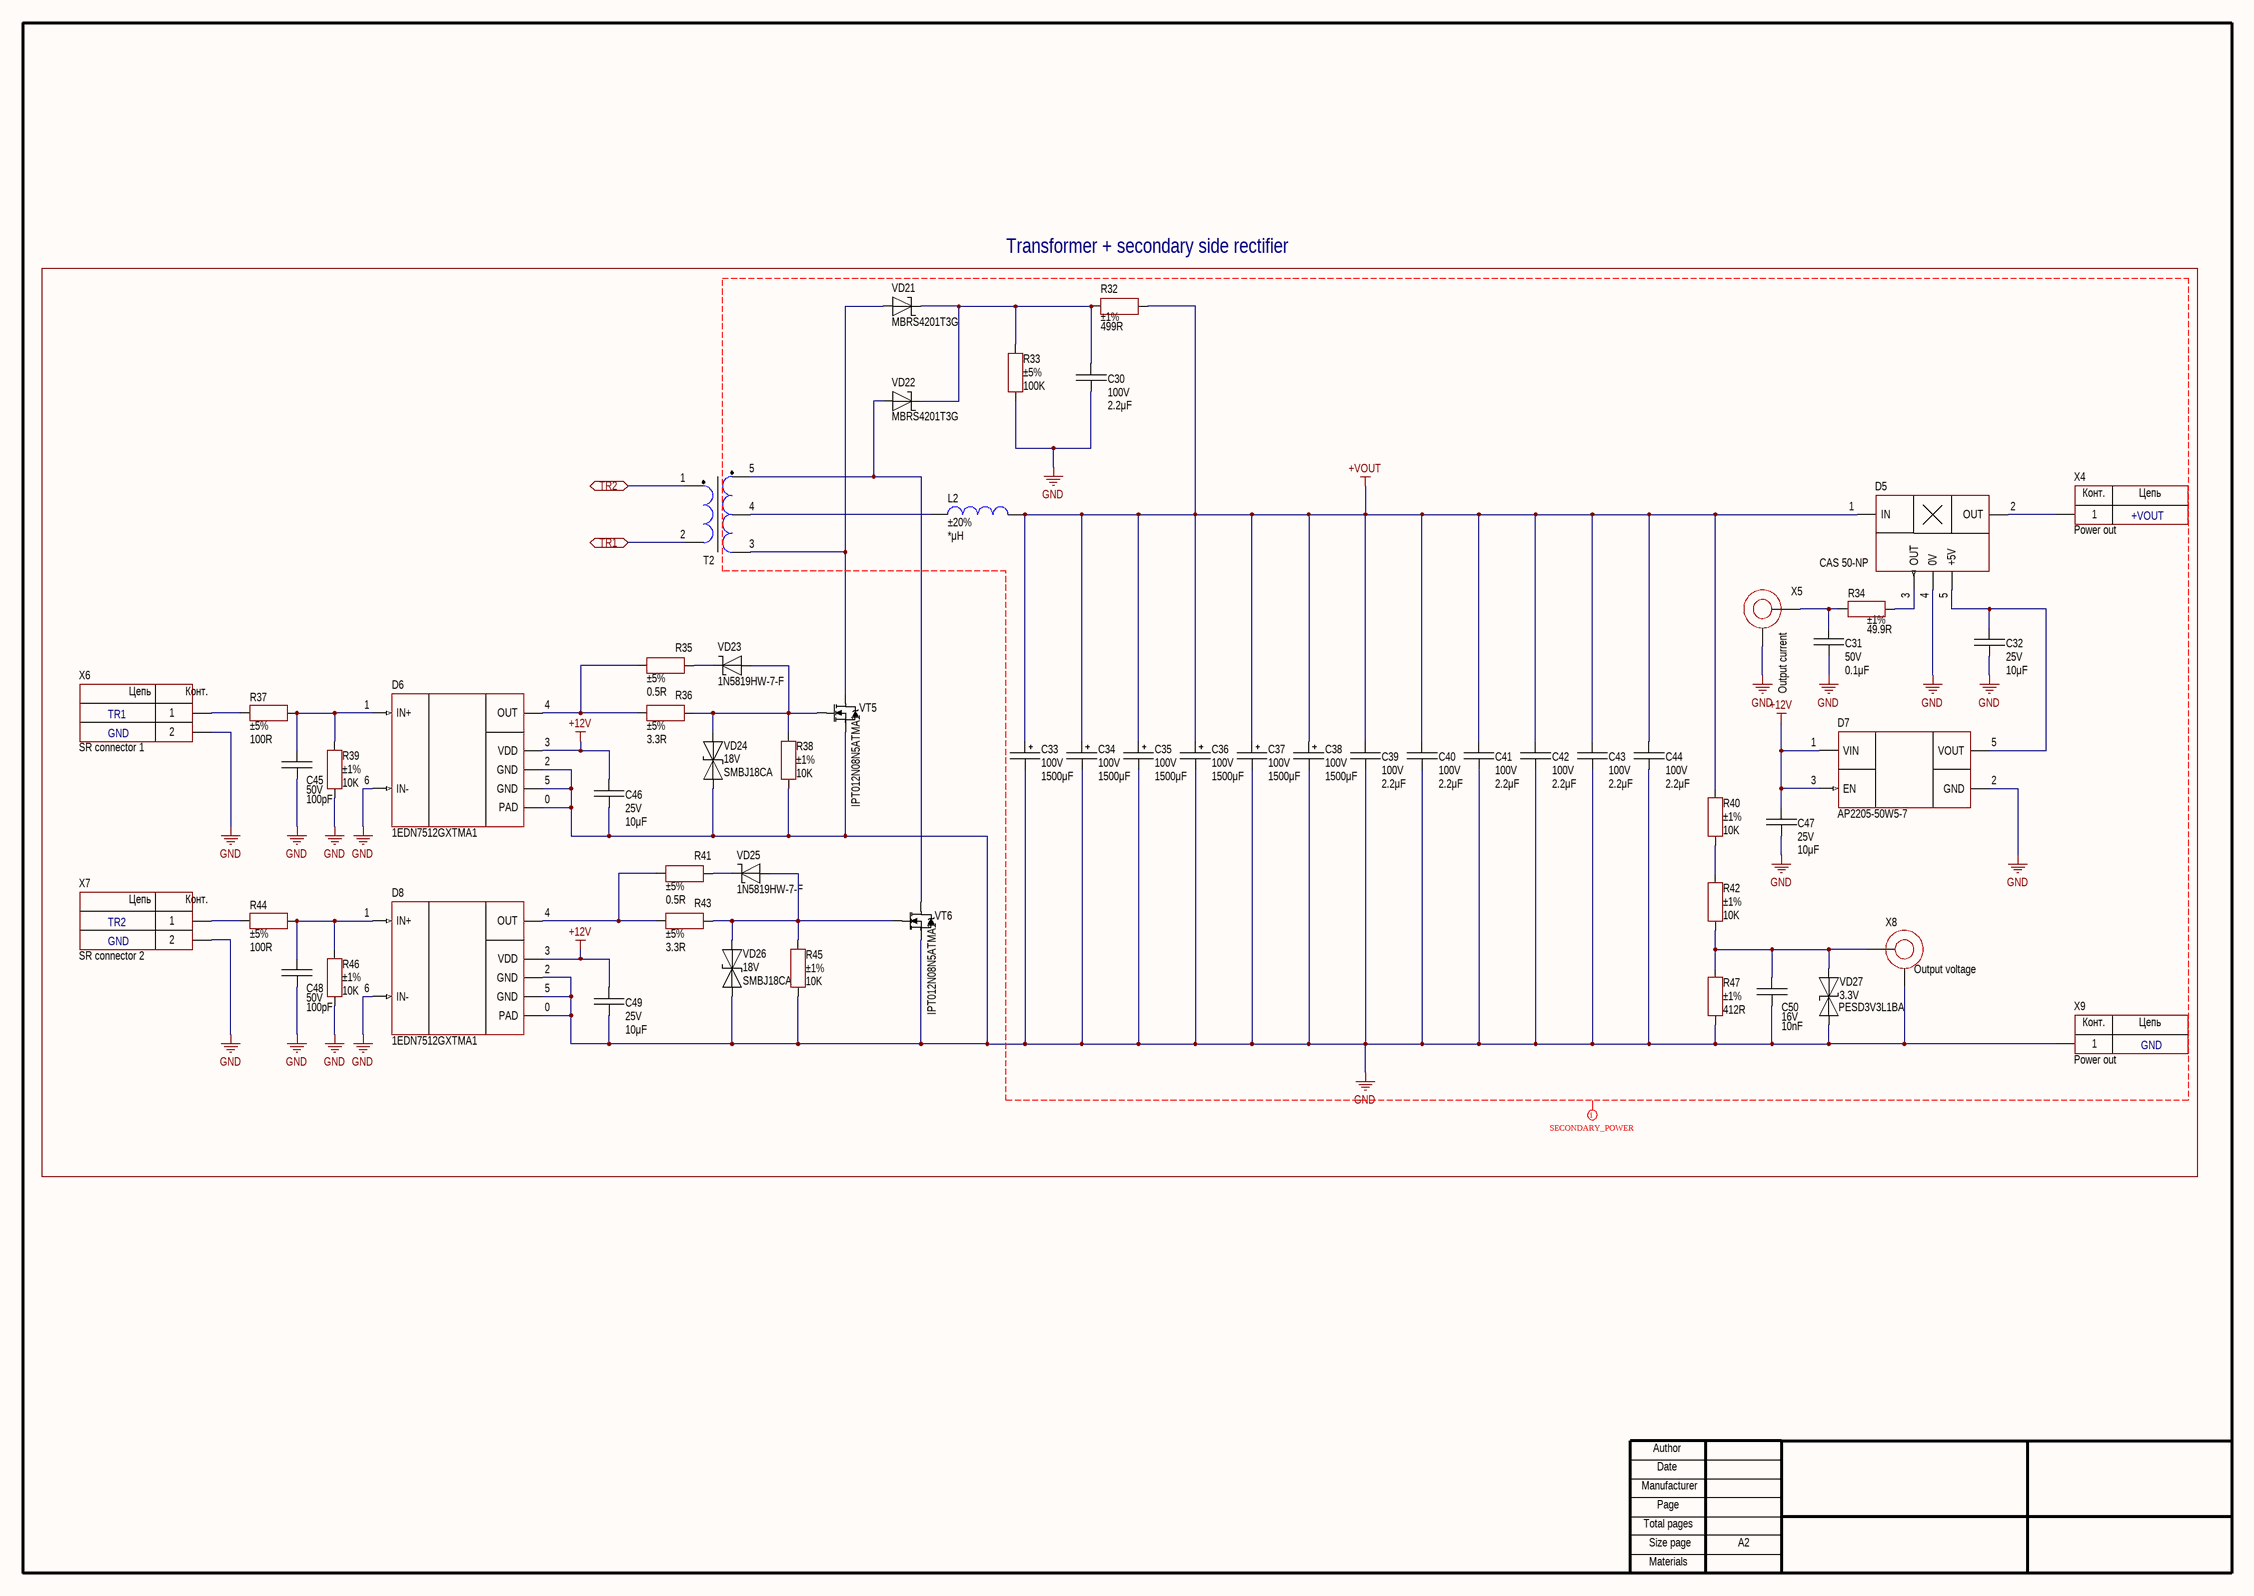
[diagram p4: PSFB_transformer.SchDoc]

### Parts
C30  value 2.2μF  Voltage: 100V  [CAP: 1206]
C31  value 0.1μF  Voltage: 50V  [CAP: 0805]
C32  value 10μF  Voltage: 25V  [CAP: 1206]
C33  value 1500μF  Voltage: 100V  [CAP: D30C10H37]
C34  value 1500μF  Voltage: 100V  [CAP: D30C10H37]
C35  value 1500μF  Voltage: 100V  [CAP: D30C10H37]
C36  value 1500μF  Voltage: 100V  [CAP: D30C10H37]
C37  value 1500μF  Voltage: 100V  [CAP: D30C10H37]
C38  value 1500μF  Voltage: 100V  [CAP: D30C10H37]
C39  value 2.2μF  Voltage: 100V  [CAP: 1206]
C40  value 2.2μF  Voltage: 100V  [CAP: 1206]
C41  value 2.2μF  Voltage: 100V  [CAP: 1206]
C42  value 2.2μF  Voltage: 100V  [CAP: 1206]
C43  value 2.2μF  Voltage: 100V  [CAP: 1206]
C44  value 2.2μF  Voltage: 100V  [CAP: 1206]
C45  value 100pF  Voltage: 50V  [CAP: 0805]
C46  value 10μF  Voltage: 25V  [CAP: 1206]
C47  value 10μF  Voltage: 25V  [CAP: 1206]
C48  value 100pF  Voltage: 50V  [CAP: 0805]
C49  value 10μF  Voltage: 25V  [CAP: 1206]
C50  value 10nF  Voltage: 16V  [CAP: 0805]
D5  PartNumber: CAS 50-NP  [SENSOR: LTS 25-NP]
D6  PartNumber: 1EDN7512GXTMA1  [6-WDFN]
D7  PartNumber: AP2205-50W5-7  [SOT23-5]
D8  PartNumber: 1EDN7512GXTMA1  [6-WDFN]
L2  value *μH  Tolerance: ±20%  [IND: R46.7/24.1/18 (H)]
R32  value 499R  Tolerance: ±1%  [RES: 2512]
R33  value 100K  Tolerance: ±5%  [RES: 1206]
R34  value 49.9R  Tolerance: ±1%  [RES: 0805]
R35  value 0.5R  Tolerance: ±5%  [RES: 1206]
R36  value 3.3R  Tolerance: ±5%  [RES: 1206]
R37  value 100R  Tolerance: ±5%  [RES: 0805]
R38  value 10K  Tolerance: ±1%  [RES: 0805]
R39  value 10K  Tolerance: ±1%  [RES: 0805]
R40  value 10K  Tolerance: ±1%  [RES: 0805]
R41  value 0.5R  Tolerance: ±5%  [RES: 1206]
R42  value 10K  Tolerance: ±1%  [RES: 0805]
R43  value 3.3R  Tolerance: ±5%  [RES: 1206]
R44  value 100R  Tolerance: ±5%  [RES: 0805]
R45  value 10K  Tolerance: ±1%  [RES: 0805]
R46  value 10K  Tolerance: ±1%  [RES: 0805]
R47  value 412R  Tolerance: ±1%  [RES: 0805]
T2  (no value)  [TRANS: ETD59/31/22_FB]
VD21  PartNumber: MBRS4201T3G  [DIODE: SMC]
VD22  PartNumber: MBRS4201T3G  [DIODE: SMC]
VD23  PartNumber: 1N5819HW-7-F  [DIODE: SOD123]
VD24  Voltage: 18V  PartNumber: SMBJ18CA  [DIODE: SMB]
VD25  PartNumber: 1N5819HW-7-F  [DIODE: SOD123]
VD26  Voltage: 18V  PartNumber: SMBJ18CA  [DIODE: SMB]
VD27  Voltage: 3.3V  PartNumber: PESD3V3L1BA  [DIODE: SOD323]
VT5  PartNumber: IPT012N08N5ATMA1  [8-TDSON]
VT6  PartNumber: IPT012N08N5ATMA1  [8-TDSON]
X4  CommentText: Power out  [7461098_for HAL]
X5  CommentText: Output current  [60311002111526]
X6  CommentText: SR connector 1  [SM02B-SRSS-TB(LF)(SN)]
X7  CommentText: SR connector 2  [SM02B-SRSS-TB(LF)(SN)]
X8  CommentText: Output voltage  [60311002111526]
X9  CommentText: Power out  [7461098_for HAL]

### Ports
TR1 (bidir), TR2 (bidir)

### Nets
+12V: C46.1 C47.1 C49.1 D6.3(VDD) D7.1(VIN) D7.3(EN) D8.3(VDD)
+VOUT: C33.1 C34.1 C35.1 C36.1 C37.1 C38.1 C39.1 C40.1 C41.1 C42.1 C43.1 C44.1 D5.1(IN) L2.1 R32.2 R40.2
GND: C30.2 C31.1 C32.2 C33.2 C34.2 C35.2 C36.2 C37.2 C38.2 C39.2 C40.2 C41.2 C42.2 C43.2 C44.2 C45.1 C46.2 C47.2 C48.1 C49.2 C50.1 D5.4(0V) D6.0(PAD) D6.2(GND) D6.5(GND) D6.6(IN-) D7.2(GND) D8.0(PAD) D8.2(GND) D8.5(GND) D8.6(IN-) R33.1 R38.1 R39.1 R45.1 R46.1 R47.1 VD24.2(C) VD26.2(C) VD27.1(A) VT5.3(S) VT6.3(S) X5.2 X6.2 X7.2 X8.2 X9.1
NetC10_M4_2: T2.2 ; port TR1
NetC27_2: T2.1 ; port TR2
NetC30_1: C30.1 R32.1 R33.2 VD21.2 VD22.2
NetC31_2: C31.2 R34.2 X5.1
NetC32_1: C32.1 D5.5(+5V) D7.5(VOUT)
NetC45_2: C45.2 D6.1(IN+) R37.2 R39.2
NetC48_2: C48.2 D8.1(IN+) R44.2 R46.2
NetC50_2: C50.2 R42.1 R47.2 VD27.2(C) X8.1
NetD5_2: D5.2(OUT) X4.1
NetD5_3: D5.3(OUT) R34.1
NetD6_4: D6.4(OUT) R35.1 R36.1
NetD8_4: D8.4(OUT) R41.1 R43.1
NetL2_2: L2.2 T2.4
NetR35_2: R35.2 VD23.2
NetR36_2: R36.2 R38.2 VD23.1 VD24.1(A) VT5.1(G)
NetR37_1: R37.1 X6.1
NetR40_1: R40.1 R42.2
NetR41_2: R41.2 VD25.2
NetR43_2: R43.2 R45.2 VD25.1 VD26.1(A) VT6.1(G)
NetR44_1: R44.1 X7.1
NetT2_3: T2.3 VD21.1 VT5.2(D)
NetT2_5: T2.5 VD22.1 VT6.2(D)

### Layout directives
net class SECONDARY_POWER: +12V, +VOUT, GND

### Notes on the sheet
- Transformer + secondary side rectifier
- +VOUT
- TR1
- GND
- TR2
- Author
- Manufacturer
- Date
- Page
- Total pages
- Size page
- A2
- Materials
- (in symbol Connector_single_power) Конт.; Цепь
- (in symbol Connector_SM02B-SRSS) Цепь; Конт.

### Library data of the parts
C30 C39-C44 = Ceramic_1206: 2.2µF ±10% 100V Ceramic Capacitor X7R 1206 (3216 Metric); Manufacturer: Yageo; PartNumber: CC1206KKX7R0BB225; ValueManufacturerPartNumber: Ceramic capacitor, 2.2μF, X7R, ±10%, 100V, 1206, -55...+125°C; Package: 1206; HelpURL: https://www.digikey.com/en/products/detail/yageo/CC1206KKX7R0BB225/5884563; Temperature: -55...+125°C; TypeCapacitor: Ceramic capacitor; Tolerance: ±10%; TypeDielectric: X7R
C31 = Ceramic_0805: 0.1µF ±10% 50V Ceramic Capacitor X7R 0805 (2012 Metric); Manufacturer: Yageo; PartNumber: CC0805KRX7R9BB104; ValueManufacturerPartNumber: Ceramic capacitor, 0.1μF, X7R, ±10%, 50V, 0805, -55...+125°C; Package: 0805; HelpURL: https://www.digikey.com/en/products/detail/yageo/CC0805KRX7R9BB104/302874; Temperature: -55...+125°C; TypeCapacitor: Ceramic capacitor; Tolerance: ±10%; TypeDielectric: X7R
C32 C46 C47 C49 = Ceramic_1206: as C1 on sheet PSFB_bus_sense; Package: 1206; HelpURL: https://www.digikey.com/en/products/detail/yageo/CC1206KKX7R8BB106/5195365; Temperature: -55...+125°C; TypeCapacitor: Ceramic capacitor; Tolerance: ±10%; TypeDielectric: X7R
C33-C38 = Aluminium: 1500µF 100V Aluminum Electrolytic Capacitors Radial, Can - Snap-In  5000 Hrs @ 105°C; Manufacturer: Nichicon; PartNumber: LGY2A152MELB30; TypeCapacitor: Aluminium capacitor; Tolerance: ±20%; Package: 37x30x10 mm; HelpURL: https://www.digikey.com/en/products/detail/nichicon/LGY2A152MELB30/2540916; ValueManufacturerPartNumber: =TypeCapacitor+', '+Value+', '+Voltage+', '+Tolerance+', '+Impedance+', '+Package+', '+Temperature; Temperature: -55...+105°C
C45 C48 = Ceramic_0805: as C19 on sheet PSFB_gate_driver_sch; Package: 0805; HelpURL: https://www.digikey.com/en/products/detail/yageo/CC0805JRNPO9BN101/302845; Temperature: -55...+125°C; TypeCapacitor: Ceramic capacitor; TypeDielectric: NP0
C50 = Ceramic_0805: as C5 on sheet PSFB_bus_sense; Package: 0805; HelpURL: https://www.digikey.com/en/products/detail/yageo/CC0805JKNPO7BN103/5884010; Temperature: -55...+125°C; TypeCapacitor: Ceramic capacitor; TypeDielectric: NP0
D5 = LTS 25-NP: Current Sensor 50A 1 Channel Flux Gate, Closed Loop Bidirectional Module; Manufacturer: LEM; ValueManufacturerPartNumber: IC current sensors, 50A, ±0.2%, 400 kHz, 12.5mV/A, -40...+85°C; Supply: 5V; Accuracy: ±0.2%; GainBandwidth: 400 kHz; Sensitivity: 12.5mV/A; HelpURL: https://www.digikey.com/en/products/detail/lem-usa-inc/CAS-50-NP/2038403; Package: Module; ComponentType: IC current sensors; Temperature: -40...+85°C; Sensing: 50A
D6 D8 = 1EDN7512BXTSA1: Low-Side Gate Driver IC Inverting, Non-Inverting PG-WSON-6-1; Manufacturer: Infineon; ValueManufacturerPartNumber: Low gate driver, Non-Inverting, complementary, +4/-8A, 6.5/4.5ns, 4.5...20V, -55...+150°C, 6-WDFN; VoltageSupply: 4.5...20V; Frequency: complementary; CurrentOutput: +4/-8A; CMTI: 6.5/4.5ns; HelpURL: https://www.digikey.com/en/products/detail/infineon-technologies/1EDN7512GXTMA1/6565754; Package: 6-WDFN; ComponentType: Low gate driver; Temperature: -55...+150°C; VoltageWork: Non-Inverting
D7 = AP2204K-3.3TRG1: Linear Voltage Regulator IC Positive Fixed 1 Output  250mA SOT-25; Manufacturer: Diodes Incorporated; ValueManufacturerPartNumber: Linear voltage regulator, input 4...24V, 0.5V, output 5.0V, 0.25A, -40...+85°C, SOT23-6; VoltageInput: input 4...24V; MaxDropout: 0.5V; CurrentOutput: 0.25A; VoltageOutput: output 5.0V; HelpURL: https://www.digikey.com/en/products/detail/diodes-incorporated/AP2205-50W5-7/10294899; Package: SOT23-6; ComponentType: Linear voltage regulator; Temperature: -40...+85°C
L2 = Inductor_R46.7/24.1/18: Custom inductor, DNP; Manufacturer: Magnetics; PartNumber: 0077438A7; ValueManufacturerPartNumber: Fixed inductor, *μH, ±20%, R46.7/24.1/18, Kool Mu, µ=125, 281 нГн/витков2; TypeInductor: Fixed inductor; TypeMatiriel: Kool Mu; AL: 281 нГн/витков2; MaterialPermeability: µ=125; Package: R46.7/24.1/18; HelpURL: http://ferrite.ru/warehouse/r-46-7-24-1-18-77438-a7.html
R32 = Resistor_2512: as R26 on sheet PSFB_power; Package: 2512; HelpURL: https://www.digikey.com/en/products/detail/yageo/RC2512FK-07499RL/5922242; Temperature: -55...+125°C; Power: 1W
R33 = Resistor_1206: 100 kOhms ±5% 0.25W, 1/4W Chip Resistor 1206 (3216 Metric) Moisture Resistant Thick Film; Manufacturer: Yageo; PartNumber: RC1206JR-07100KL; ValueManufacturerPartNumber: Resistor film, 100K, ±5%, 1206, 0.25W, -55...+125°C; TypeResistor: Resistor film; Package: 1206; HelpURL: https://www.digikey.com/en/products/detail/yageo/RC1206JR-07100KL/729207; Temperature: -55...+125°C; Power: 0.25W
R34 = Resistor_0805: as R2 on sheet PSFB_bus_sense; Package: 0805; HelpURL: https://www.digikey.com/en/products/detail/yageo/RC0805FR-0749R9L/727984; Temperature: -55...+125°C; Power: 0.125W
R35 R41 = Resistor_1206: 500 mOhms ±5% 0.25W, 1/4W Chip Resistor 1206 (3216 Metric) Automotive AEC-Q200, Current Sense, Moisture Resistant Thick Film; Manufacturer: Yageo; PartNumber: RL1206JR-070R5L; ValueManufacturerPartNumber: Resistor film, 0.5R, ±5%, 1206, 0.25W, -55...+125°C; TypeResistor: Resistor film; Package: 1206; HelpURL: https://www.digikey.com/en/products/detail/yageo/RL1206JR-070R5L/5925150; Temperature: -55...+125°C; Power: 0.25W
R36 R43 = Resistor_1206: 3.3 Ohms ±5% 0.25W, 1/4W Chip Resistor 1206 (3216 Metric) Moisture Resistant Thick Film; Manufacturer: Yageo; PartNumber: RC1206JR-073R3L; ValueManufacturerPartNumber: Resistor film, 3.3R, ±5%, 1206, 0.25W, -55...+125°C; TypeResistor: Resistor film; Package: 1206; HelpURL: https://www.digikey.com/en/products/detail/yageo/RC1206JR-073R3L/729266; Temperature: -55...+125°C; Power: 0.25W
R37 R44 = Resistor_0805: as R12 on sheet PSFB_gate_driver_sch; Package: 0805; HelpURL: https://www.digikey.com/product-detail/en/yageo/RC0805JR-07100RL/311-100ARCT-ND/731185; Temperature: -55...+125°C; Power: 0.125W
R38-R40 R42 R45 R46 = Resistor_0805: as R8 on sheet PSFB_gate_driver_sch; Package: 0805; HelpURL: https://www.digikey.com/en/products/detail/yageo/RC0805FR-0710KL/727535; Temperature: -55...+125°C; Power: 0.125W
R47 = Resistor_0805: 412 Ohms ±1% 0.125W, 1/8W Chip Resistor 0805 (2012 Metric) Moisture Resistant Thick Film; Manufacturer: Yageo; PartNumber: RC0805FR-07412RL; ValueManufacturerPartNumber: Resistor film, 412R, ±1%, 0805, 0.125W, -55...+125°C; TypeResistor: Resistor film; Package: 0805; HelpURL: https://www.digikey.com/en/products/detail/yageo/RC0805FR-07412RL/727946; Temperature: -55...+125°C; Power: 0.125W
T2 = ETD59/31/22_FB: N97 B66397G0000X197 сore / B66398W1024T001 coil former; Manufacturer: Epcos; TypeTransformer: Transformer; HelpURL: https://www.digikey.com/en/products/detail/epcos-tdk-electronics/B66398W1024T001/3914904; ValueManufacturerPartNumber: =TypeTransformer+', '+Package; PartNumber: B66398W1024T001
VD21 VD22 = Schottky_single: Diode Schottky 200V 4A Surface Mount SMC; Manufacturer: Diodes Incorporated; ValueManufacturerPartNumber: Schottky diode, 200V, 1A, 0.45V, 20pF, SMC, -55...+150°C; TypeDiode: Schottky diode; Current: 1A; VoltageDrop: 0.45V; RecoveryTime: 20pF; Package: SMC; HelpURL: https://www.digikey.com/en/products/detail/on-semiconductor/MBRS4201T3G/1087352; Temperature: -55...+150°C; Voltage: 200V
VD23 VD25 = Schottky_single: as VD5 on sheet PSFB_gate_driver_sch; Package: SOD-123; HelpURL: https://www.digikey.com/en/products/detail/diodes-incorporated/1N5819HW-7-F/814970; Temperature: -55...+150°C; Voltage: 40V; Current: 1A
VD24 VD26 = TVS_single: as VD15 on sheet PSFB_power; Package: SMB; HelpURL: https://www.digikey.com/en/products/detail/littelfuse-inc/SMBJ18CA/285986; ValueManufacturerPartNumber: =TypeDiode+', '+Voltage+', '+Current+', '+VoltageDrop+', '+RecoveryTime+', '+Package+', '+Temperature; Temperature: -55...+150°C; TypeDiode: TVS diode
VD27 = TVS_single: as VD1 on sheet PSFB_bus_sense; Package: SOD-323; HelpURL: https://www.digikey.com/en/products/detail/nexperia-usa-inc/PESD3V3L1BA-115/1157438; ValueManufacturerPartNumber: =TypeDiode+', '+Voltage+', '+Current+', '+VoltageDrop+', '+RecoveryTime+', '+Package+', '+Temperature; Temperature: -55...+150°C; TypeDiode: TVS diode
VT5 VT6 = MOSFET_N_123: N-Channel 80V 300A (Tc) 375W (Tc) Surface Mount PG-HSOF-8-1; Manufacturer: Infineon Technologies; ValueManufacturerPartNumber: MOSFET N-channel transistor, 100V, 300A, 223nC, 375W, 1.2mOhm, 17000pF, 8-TDSON, -55...+150°C; TypeTransistor: MOSFET N-channel transistor; VoltageDS: 100V; RDS: 1.2mOhm; GateCharge: 223nC; InputCapacitor: 17000pF; Package: 8-TDSON; HelpURL: https://www.digikey.com/en/products/detail/IPT012N08N5ATMA1/IPT012N08N5ATMA1CT-ND/5413752; Temperature: -55...+150°C; CurrentDS: 300A; MaxPower: 375W
X4 X9 = Connector_single_power: 25 Pin Shank Terminal M6 Through Hole; Manufacturer: Würth Elektronik; PartNumber: 7461098; TypeConnector: Power connector; CurrentMax: 250A; HelpURL: https://www.digikey.com/en/products/detail/w%C3%BCrth-elektronik/7461098/2092196; ValueManufacturerPartNumber: =TypeConnector+', '+VoltageMax+', '+CurrentMax
X5 X8 = Connector_SMA: as X1 on sheet PSFB_bus_sense; HelpURL: https://www.we-online.com/catalog/en/WR-SMA_60311002111526; PartNumber: 60311002111526; Impedance: 50 Ohm
X6 X7 = Connector_SM02B-SRSS: Connector Header Surface Mount, Right Angle 2 position 0.039" (1.00mm); Manufacturer: JST; ValueManufacturerPartNumber: Connector, 2pin, 1.00mm, 50V, 25A; VoltageMax: 50V; CurrentMax: 25A; Multichannel: 2pin; HelpURL: https://www.digikey.com/en/products/detail/jst-sales-america-inc/SM02B-SRSS-TB-LF-SN/926708; TypeConnector: Connector; PartNumber: SM02B-SRSS-TB(LF)(SN); Pitch: 1.00mm

## Sheet PSFB_low_voltage_supply.SchDoc
size 420 x 297 mm
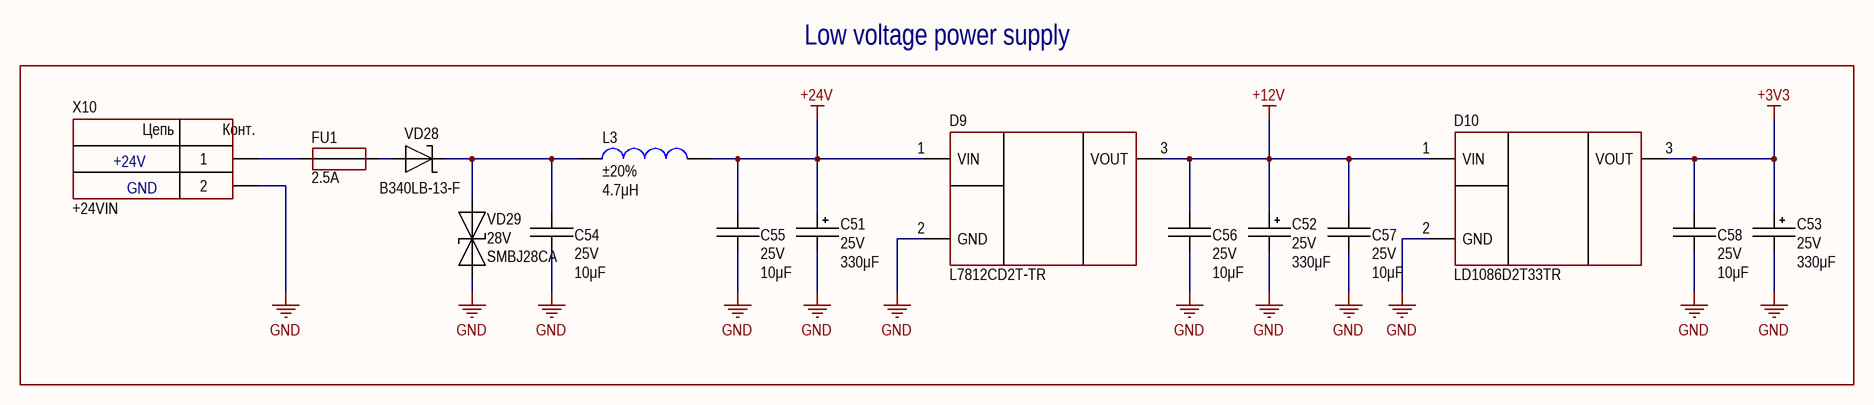
[diagram p5: PSFB_low_voltage_supply.SchDoc]

### Parts
C51  value 330μF  Voltage: 25V  [CAP: D8C3.5H12]
C52  value 330μF  Voltage: 25V  [CAP: D8C3.5H12]
C53  value 330μF  Voltage: 25V  [CAP: D8C3.5H12]
C54  value 10μF  Voltage: 25V  [CAP: 1206]
C55  value 10μF  Voltage: 25V  [CAP: 1206]
C56  value 10μF  Voltage: 25V  [CAP: 1206]
C57  value 10μF  Voltage: 25V  [CAP: 1206]
C58  value 10μF  Voltage: 25V  [CAP: 1206]
D9  PartNumber: L7812CD2T-TR  [D2PAK]
D10  PartNumber: LD1086D2T33TR  [D2PAK]
FU1  MaxCurrent: 2.5A  [FUSE: 1206]
L3  value 4.7μH  Tolerance: ±20%  [IND: SDR0403]
VD28  PartNumber: B340LB-13-F  [DIODE: SMB]
VD29  Voltage: 28V  PartNumber: SMBJ28CA  [DIODE: SMB]
X10  CommentText: +24VIN  [CON: 6PCV-02-006]

### Nets
+3V3: C53.1 C58.1 D10.3(VOUT)
+12V: C52.1 C56.1 C57.1 D9.3(VOUT) D10.1(VIN)
+24V: C51.1 C55.1 D9.1(VIN) L3.1
GND: C51.2 C52.2 C53.2 C54.2 C55.2 C56.2 C57.2 C58.2 D9.2(GND) D10.2(GND) VD29.2(C) X10.2
NetC54_1: C54.1 L3.2 VD28.2 VD29.1(A)
NetFU1_1: FU1.1 X10.1
NetFU1_2: FU1.2 VD28.1

### Notes on the sheet
- Low voltage power supply
- +24V
- GND
- Author
- Manufacturer
- Date
- Page
- Total pages
- Size page
- A3
- Materials
- (in symbol Connector_6PCV-02) Цепь; Конт.

### Library data of the parts
C51-C53 = Aluminium: as C10 on sheet PSFB_gate_driver_sch; Package: 13x8x3.5 mm; HelpURL: https://www.digikey.com/en/products/detail/kemet/A750KS337M1EAAE018/6196447; Temperature: -55...+105°C; Impedance: 18mOhm
C54-C58 = Ceramic_1206: as C1 on sheet PSFB_bus_sense; Package: 1206; HelpURL: https://www.digikey.com/en/products/detail/yageo/CC1206KKX7R8BB106/5195365; Temperature: -55...+125°C; TypeCapacitor: Ceramic capacitor; Tolerance: ±10%; TypeDielectric: X7R
D9 = L7805ABV: Linear Voltage Regulator IC Positive Fixed 1 Output  1.5A D2PAK; Manufacturer: STMicroelectronics; ValueManufacturerPartNumber: Linear voltage regulator, input 14...35V, 2V, output 12V, 1.5A, -40...+125°C, TO-220; VoltageInput: input 14...35V; MaxDropout: 2V; VoltageOutput: output 12V; HelpURL: https://www.digikey.com/en/products/detail/stmicroelectronics/L7812CD2T-TR/585702; Package: TO-220; ComponentType: Linear voltage regulator; Temperature: -40...+125°C; CurrentOutput: 1.5A
D10 = L7805ABV: Linear Voltage Regulator IC Positive Fixed 1 Output  1.5A D2PAK; Manufacturer: STMicroelectronics; ValueManufacturerPartNumber: Linear voltage regulator, input 4.8...30V, 2V, output 3.3V, 1.5A, -40...+125°C, TO-220; VoltageInput: input 4.8...30V; MaxDropout: 2V; VoltageOutput: output 3.3V; HelpURL: https://www.digikey.com/en/products/detail/stmicroelectronics/LD1086D2T33TR/585748; Package: TO-220; ComponentType: Linear voltage regulator; Temperature: -40...+125°C; CurrentOutput: 1.5A
FU1 = Fuse: 2.5A 125V AC 63V DC Fuse Board Mount (Cartridge Style Excluded) Surface Mount 1206 (3216 Metric); Manufacturer: Bel Fuse Inc.; PartNumber: C1Q 2.5; TypeFuse: Electromechanics relay; Package: 1206; HelpURL: https://www.digikey.com/en/products/detail/bel-fuse-inc/C1Q-2-5/615152; ValueManufacturerPartNumber: =TypeFuse+', '+VoltageMax+', '+MaxCurrent+', '+Package+', '+Temperature; VoltageMax: 63V
L3 = Inductor_SDR0403: 4.7µH Unshielded Wirewound Inductor 1.7A 94mOhm Max Nonstandard; Manufacturer: Bourns; PartNumber: SDR0403-4R7ML; ValueManufacturerPartNumber: Fixed inductor, 4.7μH, ±20%, SDR0403, 1.7A, -40...+125°C; TypeInductor: Fixed inductor; Package: SDR0403; HelpURL: https://www.digikey.com/product-detail/en/bourns-inc/SDR0403-4R7ML/SDR0403-4R7MLCT-ND/2127096; Temperature: -40...+125°C; MaxCurrent: 1.7A
VD28 = Schottky_single: Diode Schottky 40V 3A Surface Mount SMB; Manufacturer: Diodes Incorporated; ValueManufacturerPartNumber: Schottky diode, 40V, 3A, 0.45V, 100pF, SMB, -55...+150°C; TypeDiode: Schottky diode; VoltageDrop: 0.45V; RecoveryTime: 100pF; Package: SMB; HelpURL: https://www.digikey.com/en/products/detail/diodes-incorporated/B340LB-13-F/755461; Temperature: -55...+150°C; Voltage: 40V; Current: 3A
VD29 = TVS_single: 45.4V Clamp 13.3A Ipp Tvs Diode Surface Mount DO-214AA (SMBJ); Manufacturer: Diodes Incorporated; Current: 600W; Package: SMB; HelpURL: https://www.digikey.com/en/products/detail/littelfuse-inc/SMBJ28CA/286003; ValueManufacturerPartNumber: =TypeDiode+', '+Voltage+', '+Current+', '+VoltageDrop+', '+RecoveryTime+', '+Package+', '+Temperature; Temperature: -55...+150°C; TypeDiode: TVS diode
X10 = Connector_6PCV-02: 2 Circuit 0.375" (9.53mm) Barrier Block Connector, Screws; Manufacturer: TE Connectivity; ValueManufacturerPartNumber: Connector, 2pin, 9.53mm, 300VAC, 25A; PartNumber: 6PCV-02-006; VoltageMax: 300VAC; CurrentMax: 25A; Multichannel: 2pin; HelpURL: https://www.digikey.com/en/products/detail/te-connectivity-amp-connectors/6PCV-02-006/1277933; TypeConnector: Connector; Pitch: 9.53mm